# EAGLE design QuackDrive (EAGLE 9.5.1)

## Sheet 1 of 3
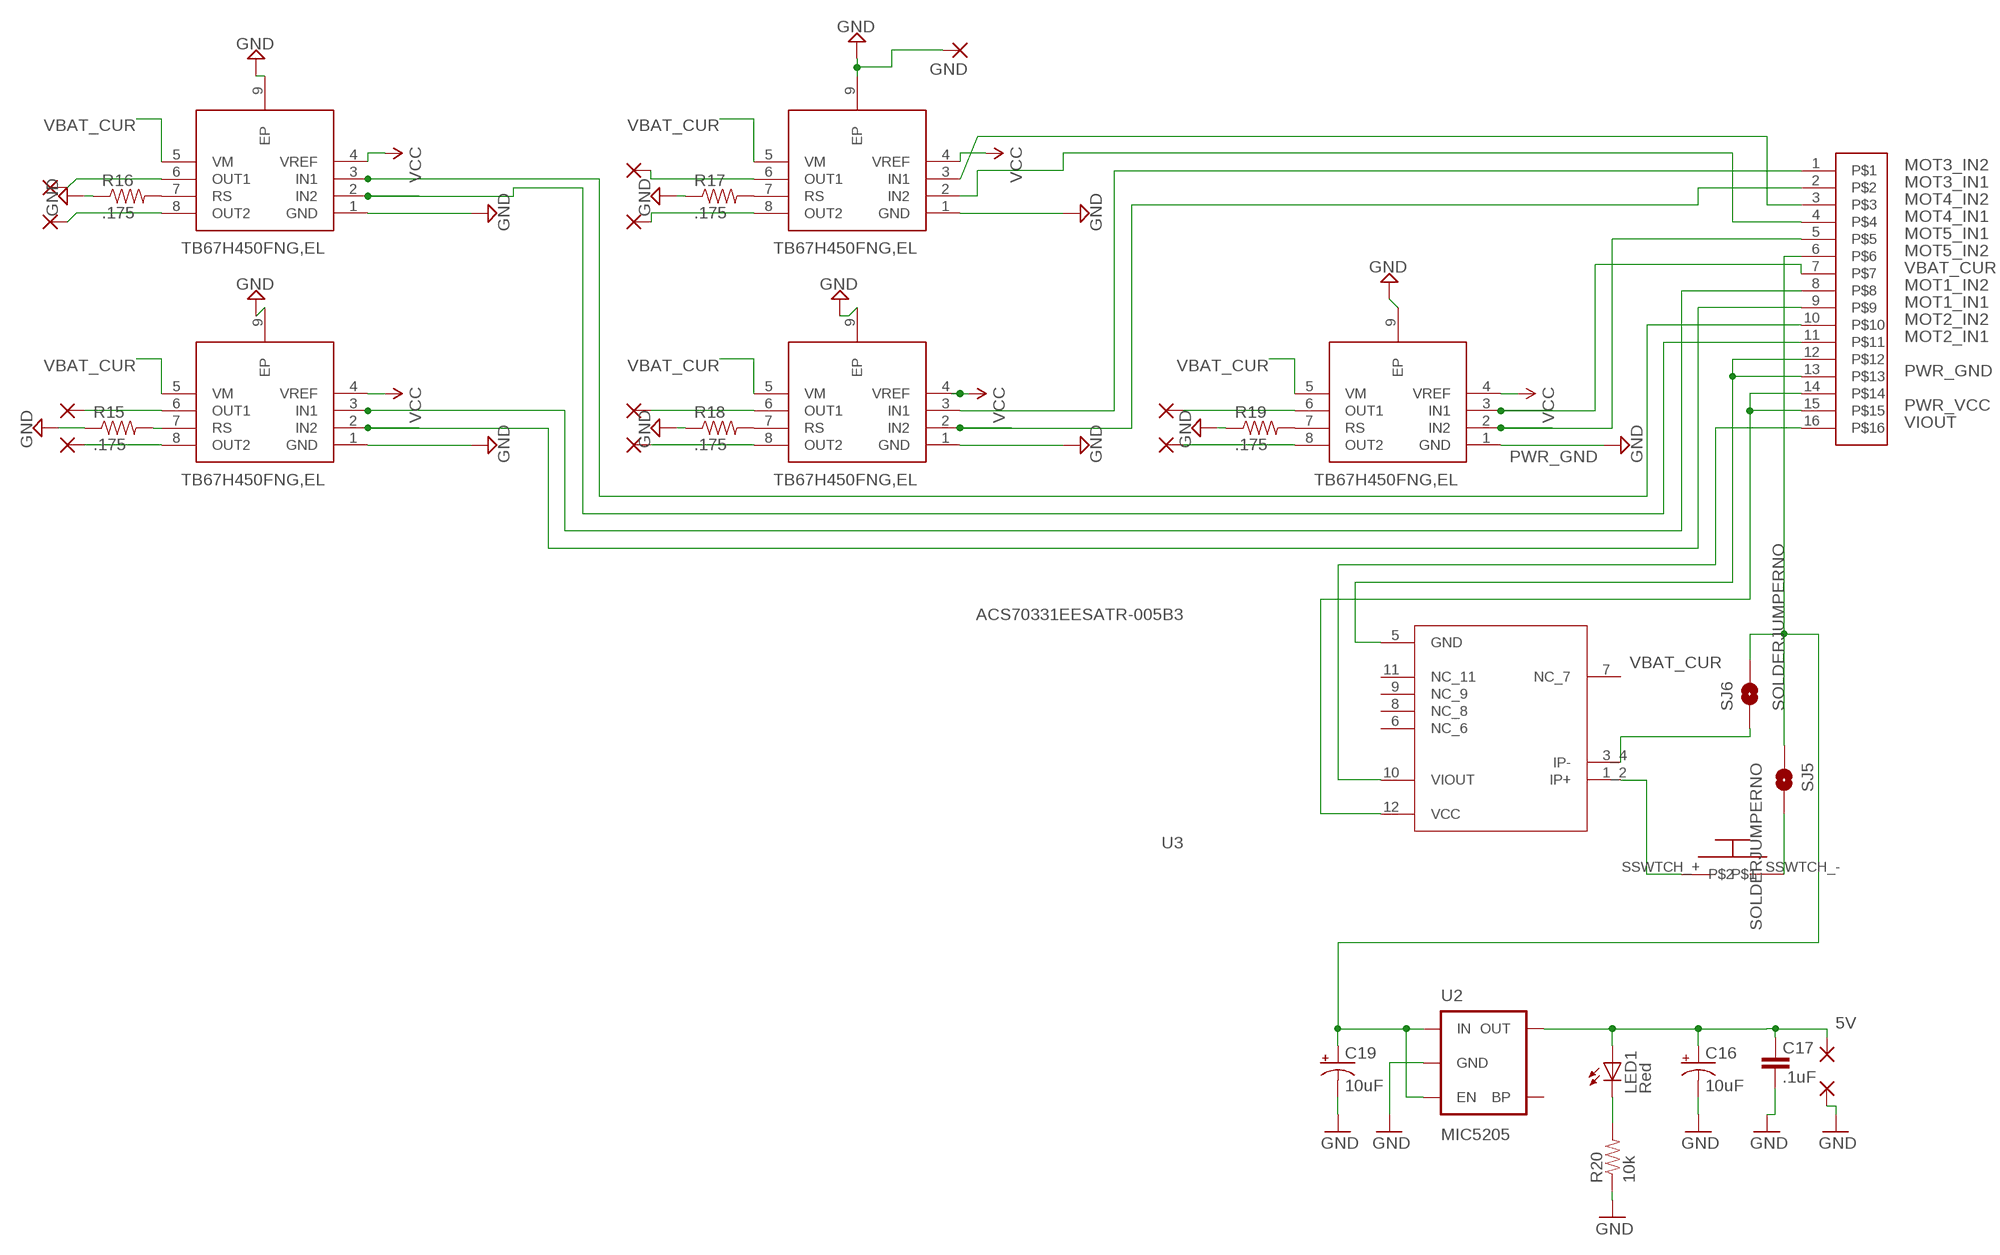
[diagram p0: schematic, sheet 1, part 1 of 2]
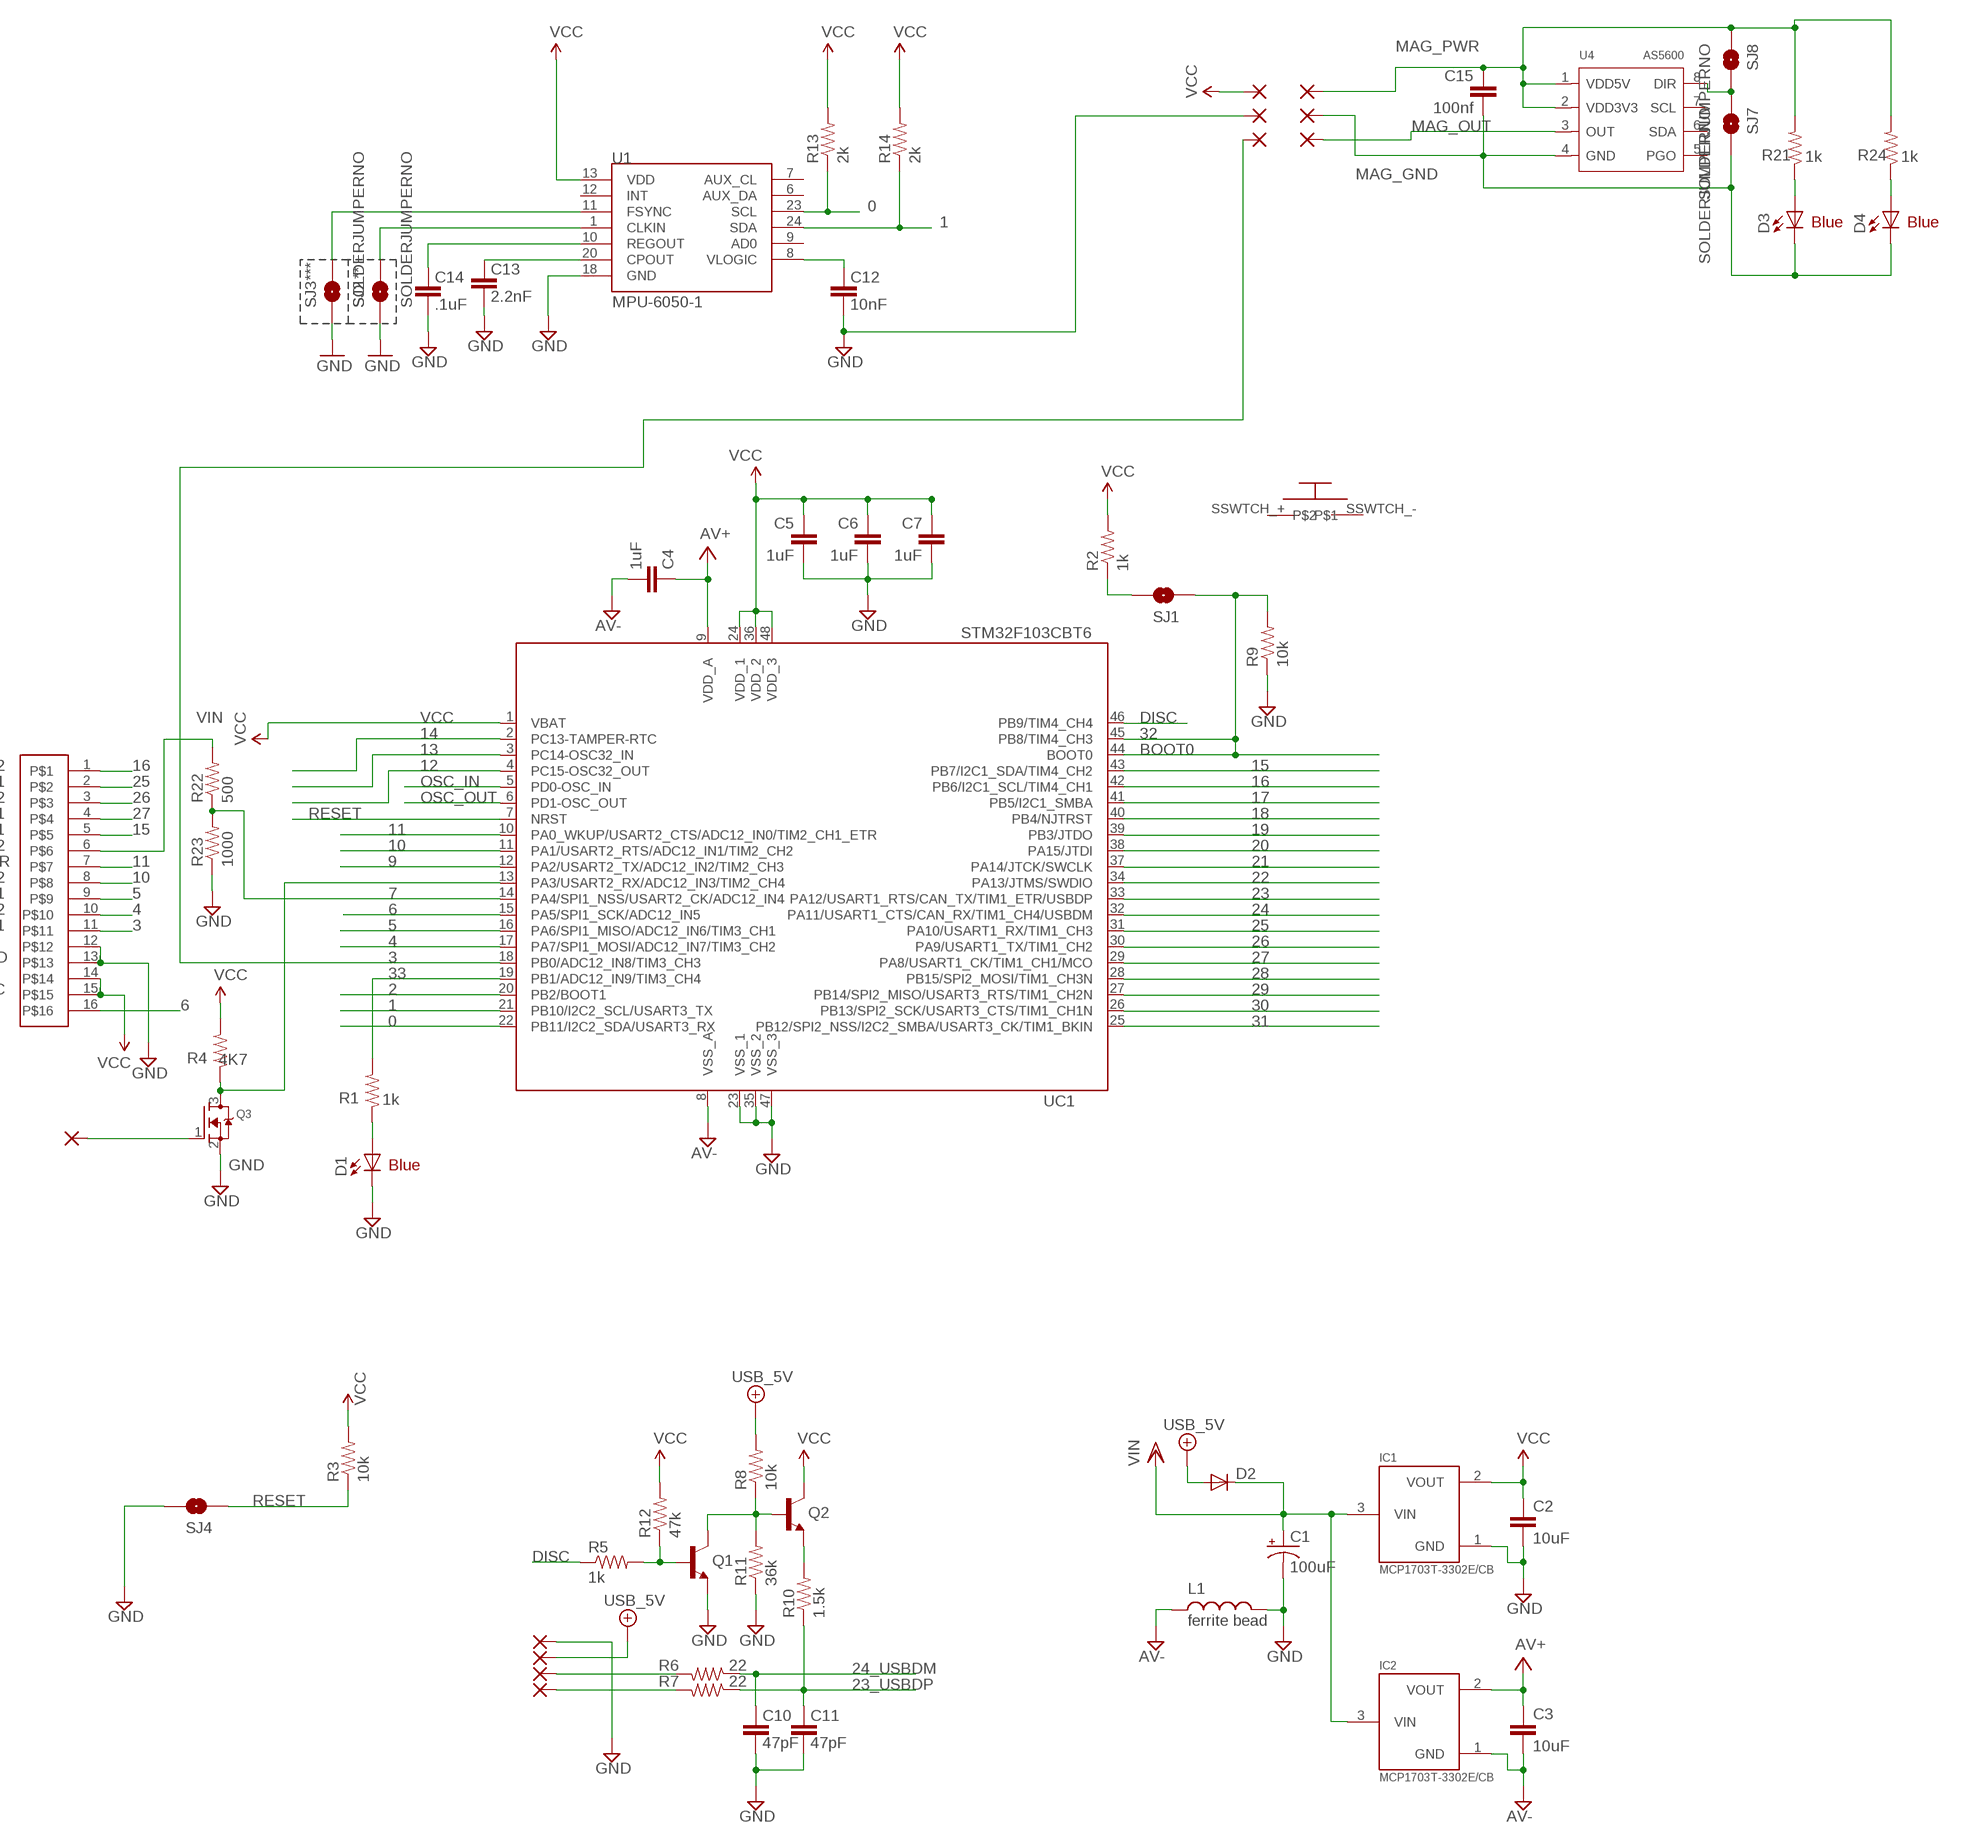
[diagram p1: schematic, sheet 1, part 2 of 2]

### Parts
C1  100uF  CAP_POL1206  [EIA3216]
C2  10uF  CAP0805  [0805]
C3  10uF  CAP0805  [0805]
C4  1uF  CAP0402  [C0402]
C5  1uF  CAP0402  [C0402]
C6  1uF  CAP0402  [C0402]
C7  1uF  CAP0402  [C0402]
C10  47pF  CAP0402  [C0402]
C11  47pF  CAP0402  [C0402]
C12  10nF  CAP0402  [C0402]
C13  2.2nF  CAP0402  [C0402]
C14  .1uF  CAP0402  [C0402]
C15  100nf  CAP0402  [C0402]
C16  10uF  CAP_POL1206  [EIA3216]
C17  .1uF  CAP0402  [C0402]
C19  10uF  CAP_POL1206  [EIA3216]
D1  Blue  LED1206  [LED-1206]
D2  DIODESOD  [SOD-323]
D3  Blue  LED1206  [LED-1206]
D4  Blue  LED1206  [LED-1206]
GND  SMD5  [SMD2,54-5,08]
IC1  MCP1703T-3302E/CB  MCP1700T  [SOT23]
IC2  MCP1703T-3302E/CB  MCP1700T  [SOT23]
IC4  TB67H450FNG,EL  [SOIC127P600X175-9N]
IC6  TB67H450FNG,EL  [SOIC127P600X175-9N]
IC8  TB67H450FNG,EL  [SOIC127P600X175-9N]
IC10  TB67H450FNG,EL  [SOIC127P600X175-9N]
IC12  TB67H450FNG,EL  [SOIC127P600X175-9N]
L1  ferrite bead  INDUCTOR0603  [0603]
LED1  Red  LED  [0603-LED-ALT1]
PAD1  WIREPADSMD1,27-254  [SMD1,27-2,54]
PAD2  WIREPADSMD1,27-254  [SMD1,27-2,54]
PAD3  WIREPADSMD1,27-254  [SMD1,27-2,54]
PAD4  SMD2  [SMD1,27-2,54]
PAD5  WIREPADSMD1,27-254  [SMD1,27-2,54]
PAD6  WIREPADSMD1,27-254  [SMD1,27-2,54]
PAD7  SMD2  [SMD1,27-2,54]
PAD8  WIREPADSMD1,27-254  [SMD1,27-2,54]
PAD9  WIREPADSMD1,27-254  [SMD1,27-2,54]
PAD10  WIREPADSMD1,27-254  [SMD1,27-2,54]
PAD11  WIREPADSMD1,27-254  [SMD1,27-2,54]
PAD12  WIREPADSMD1,27-254  [SMD1,27-2,54]
PAD13  SMD2  [SMD1,27-2,54]
PAD14  SMD2  [SMD1,27-2,54]
PAD15  SMD2  [SMD1,27-2,54]
PAD16  SMD2  [SMD1,27-2,54]
PAD17  SMD2  [SMD1,27-2,54]
PAD18  SMD2  [SMD1,27-2,54]
PAD19  SMD2  [SMD1,27-2,54]
PAD20  SMD2  [SMD1,27-2,54]
PAD21  SMD2  [SMD1,27-2,54]
PAD22  SMD2  [SMD1,27-2,54]
PAD23  SMD2  [SMD1,27-2,54]
Q1  NPN-BJT  TRANSISTOR_NPNSOT23  [SOT23]
Q2  NPN-BJT  TRANSISTOR_NPNSOT23  [SOT23]
Q3  MOSFET-NREFLOW  [SOT23]
R1  1k  RESISTOR0402  [C0402]
R2  1k  RESISTOR0402  [C0402]
R3  10k  RESISTOR0402  [C0402]
R4  4K7  RESISTOR0402  [C0402]
R5  1k  RESISTOR0402  [C0402]
R6  22  RESISTOR0402  [C0402]
R7  22  RESISTOR0402  [C0402]
R8  10k  RESISTOR0402  [C0402]
R9  10k  RESISTOR0402  [C0402]
R10  1.5k  RESISTOR0402  [C0402]
R11  36k  RESISTOR0402  [C0402]
R12  47k  RESISTOR0402  [C0402]
R13  2k  RESISTOR0402  [C0402]
R14  2k  RESISTOR0402  [C0402]
R15  .175  RESISTOR0402  [C0402]
R16  .175  RESISTOR0402  [C0402]
R17  .175  RESISTOR0402  [C0402]
R18  .175  RESISTOR0402  [C0402]
R19  .175  RESISTOR0402  [C0402]
R20  10k  RESISTOR0402  [C0402]
R21  1k  RESISTOR0402  [C0402]
R22  500  RESISTOR0402  [C0402]
R23  1000  RESISTOR0402  [C0402]
R24  1k  RESISTOR0402  [C0402]
SJ1  SOLDERJUMPERNO  [SJ_2S-NO]
SJ2  SOLDERJUMPERNO  [SJ_2S-NO]
SJ3  SOLDERJUMPERNO  [SJ_2S-NO]
SJ4  SOLDERJUMPERNO  [SJ_2S-NO]
SJ5  SOLDERJUMPERNO  [SJ_2S-NO]
SJ6  SOLDERJUMPERNO  [SJ_2S-NO]
SJ7  SOLDERJUMPERNO  [SJ_2S-NO]
SJ8  SOLDERJUMPERNO  [SJ_2S-NO]
U1  MPU-6050-1  [QFN-24-4MM2]
U2  MIC5205  V_REG_LDOSMD  [SOT23-5]
U3  ACS70331EESATR-005B3  [XDCR_ACS70331EESATR-005B3]
U4  AS5600  SENSOR-AS5600  [SOIC8-1.27-5X4MM]
U$1  WM8952DKR  [SOP80P420X355-16N]
U$2  SSWTCH  [SSWITCH]
U$3  WM8952DKR  [SOP80P420X355-16N]
U$4  SSWTCH  [SSWITCH]
UC1  STM32F103CBT6  STM32F103CB  [LQFP48]

### Nets
0: R13.1 U1.23(SCL) UC1.22(PB11/I2C2_SDA/USART3_RX)
1: R14.1 U1.24(SDA) UC1.21(PB10/I2C2_SCL/USART3_TX)
2: UC1.20(PB2/BOOT1)
3: PAD14.1(P) U$3.11 UC1.18(PB0/ADC12_IN8/TIM3_CH3)
4: U$3.10 UC1.17(PA7/SPI1_MOSI/ADC12_IN7/TIM3_CH2)
5: U$3.9 UC1.16(PA6/SPI1_MISO/ADC12_IN6/TIM3_CH1)
5V [vcc]: C16.A(+) C17.2 LED1.A PAD21.1(P) U2.5(OUT)
6: U$3.16 UC1.15(PA5/SPI1_SCK/ADC12_IN5)
7: R22.1 R23.2 UC1.14(PA4/SPI1_NSS/USART2_CK/ADC12_IN4)
9: UC1.12(PA2/USART2_TX/ADC12_IN2/TIM2_CH3)
10: U$3.8 UC1.11(PA1/USART2_RTS/ADC12_IN1/TIM2_CH2)
11: U$3.7 UC1.10(PA0_WKUP/USART2_CTS/ADC12_IN0/TIM2_CH1_ETR)
12: UC1.4(PC15-OSC32_OUT)
13: UC1.3(PC14-OSC32_IN)
14: UC1.2(PC13-TAMPER-RTC)
15: U$3.5 UC1.43(PB7/I2C1_SDA/TIM4_CH2)
16: U$3.1 UC1.42(PB6/I2C1_SCL/TIM4_CH1)
17: UC1.41(PB5/I2C1_SMBA)
18: UC1.40(PB4/NJTRST)
19: UC1.39(PB3/JTDO)
20: UC1.38(PA15/JTDI)
21: UC1.37(PA14/JTCK/SWCLK)
22: UC1.34(PA13/JTMS/SWDIO)
23: UC1.33(PA12/USART1_RTS/CAN_TX/TIM1_ETR/USBDP)
23_USBDP: C11.2 R7.1 R10.1
24: UC1.32(PA11/USART1_CTS/CAN_RX/TIM1_CH4/USBDM)
24_USBDM: C10.2 R6.1
25: U$3.2 UC1.31(PA10/USART1_RX/TIM1_CH3)
26: U$3.3 UC1.30(PA9/USART1_TX/TIM1_CH2)
27: U$3.4 UC1.29(PA8/USART1_CK/TIM1_CH1/MCO)
28: UC1.28(PB15/SPI2_MOSI/TIM1_CH3N)
29: UC1.27(PB14/SPI2_MISO/USART3_RTS/TIM1_CH2N)
30: UC1.26(PB13/SPI2_SCK/USART3_CTS/TIM1_CH1N)
31: UC1.25(PB12/SPI2_NSS/I2C2_SMBA/USART3_CK/TIM1_BKIN)
32: R9.2 SJ1.1 UC1.44(BOOT0) UC1.45(PB8/TIM4_CH3)
33: R1.2 UC1.19(PB1/ADC12_IN9/TIM3_CH4)
+5V/2: D2.2(A) PAD18.1(P) R8.2 ; supply symbol labelled USB_5V
AV+: C3.1 C4.1 IC2.2(VOUT) UC1.9(VDD_A)
AV-: C3.2 C4.2 IC2.1(GND) L1.1 UC1.8(VSS_A)
CLKIN1: SJ2.2 U1.1(CLKIN)
DISC: R5.1 UC1.46(PB9/TIM4_CH4)
FSYNC1: SJ3.2 U1.11(FSYNC)
GND: C1.C(-) C2.2 C5.2 C6.2 C7.2 C10.1 C11.1 C12.1 C13.1 C14.1 D1.C IC1.1(GND) L1.2 PAD15.1(P) PAD17.1(P) Q1.2(E) Q3.2(S) R9.1 R11.1 R23.1 SJ2.1 SJ3.1 SJ4.2 U1.18(GND) U$3.12 U$3.13 UC1.23(VSS_1) UC1.35(VSS_2) UC1.47(VSS_3)
MAG_GND: C15.2 D3.C D4.C PAD4.1(P) SJ7.2 U4.4(GND)
MAG_OUT: PAD13.1(P) U4.3(OUT)
MAG_PWR: C15.1 PAD7.1(P) R21.2 R24.2 SJ8.1 U4.1(VDD5V) U4.2(VDD3V3)
MOT1_IN1: IC4.2(IN2) U$1.9
MOT1_IN2: IC4.3(IN1) U$1.8
MOT2_IN1: IC6.2(IN2) U$1.11
MOT2_IN2: IC6.3(IN1) U$1.10
MOT3_IN1: IC8.2(IN2) U$1.2
MOT3_IN2: IC8.3(IN1) U$1.1
MOT4_IN1: IC10.2(IN2) U$1.4
MOT4_IN2: IC10.3(IN1) U$1.3
MOT5_IN1: IC12.2(IN2) U$1.5
MOT5_IN2: IC12.3(IN1) U$1.7
N$1: R2.1 SJ1.2
N$2: D1.A R1.1
N$4: Q3.3(D) R4.1 UC1.13(PA3/USART2_RX/ADC12_IN3/TIM2_CH4)
N$6: SJ5.2 U$2.SSWTCH_-
N$7: C12.2 U1.8(VLOGIC)
N$8: C13.2 U1.20(CPOUT)
N$9: C14.2 U1.10(REGOUT)
N$11: IC12.8(OUT2) PAD5.1(P)
N$12: IC6.7(RS) R16.2
N$13: IC12.6(OUT1) PAD6.1(P)
N$14: IC8.6(OUT1) PAD2.1(P)
N$15: IC8.8(OUT2) PAD1.1(P)
N$17: IC10.6(OUT1) PAD8.1(P)
N$18: IC10.8(OUT2) PAD3.1(P)
N$19: IC6.6(OUT1) PAD12.1(P)
N$20: IC6.8(OUT2) PAD11.1(P)
N$21: IC4.6(OUT1) PAD10.1(P)
N$22: IC4.8(OUT2) PAD9.1(P)
N$23: IC10.7(RS) R17.2
N$24: IC8.7(RS) R18.2
N$25: IC12.7(RS) R19.2
N$26: IC4.7(RS) R15.2
N$28: D3.A R21.1
N$29: SJ7.1 SJ8.2 U4.8(DIR)
N$30: LED1.C R20.2
N$32: D4.A R24.1
N$51: Q2.2(E) R10.2
N$59: PAD19.1(P) R6.2
N$60: PAD20.1(P) R7.2
N$71: Q1.3(C) Q2.1(B) R8.1 R11.2
N$73: Q1.1(B) R5.2 R12.1
OSC_IN: UC1.5(PD0-OSC_IN)
OSC_OUT: UC1.6(PD1-OSC_OUT)
PWR_GND: C16.C(-) C17.1 C19.C(-) GND.1(P) IC4.1(GND) IC4.9(EP) IC6.1(GND) IC6.9(EP) IC8.1(GND) IC8.9(EP) IC10.1(GND) IC10.9(EP) IC12.1(GND) IC12.9(EP) PAD22.1(P) R15.1 R16.1 R17.1 R18.1 R19.1 R20.1 U2.2(GND) U3.5(GND) U$1.12 U$1.13 ; supply symbol labelled GND
PWR_VCC: IC4.4(VREF) IC6.4(VREF) IC8.4(VREF) IC10.4(VREF) IC12.4(VREF) U3.12(VCC) U$1.14 U$1.15 ; supply symbol labelled VCC
RESET: R3.1 SJ4.1 UC1.7(NRST)
SBUSIN: PAD23.1(P) Q3.1(G)
VBAT_CUR: C19.A(+) IC4.5(VM) IC6.5(VM) IC8.5(VM) IC10.5(VM) IC12.5(VM) SJ5.1 SJ6.1 SJ6.2 U2.1(IN) U2.3(EN) U3.3_4(IP-) U$1.6
VBAT_IN: U3.1_2(IP+) U$2.SSWTCH_+
VCC: C2.1 C5.1 C6.1 C7.1 IC1.2(VOUT) PAD16.1(P) Q2.3(C) R2.2 R3.2 R4.2 R12.2 R13.2 R14.2 U1.13(VDD) U$3.14 U$3.15 UC1.1(VBAT) UC1.24(VDD_1) UC1.36(VDD_2) UC1.48(VDD_3)
VIN: C1.A(+) D2.1(C) IC1.3(VIN) IC2.3(VIN) R22.2 U$3.6
VIOUT: U3.10(VIOUT) U$1.16
Unconnected: U1.6(AUX_DA) U1.7(AUX_CL) U1.9(AD0) U1.12(INT) U2.4(BP) U3.6(NC_6) U3.7(NC_7) U3.8(NC_8) U3.9(NC_9) U3.11(NC_11) U4.5(PGO) U4.6(SDA) U4.7(SCL) U$4.SSWTCH_+ U$4.SSWTCH_-

### Notes on the sheet
- Blue | Blue
- *** | **
- BOOT0
- Blue

## Sheet 2 of 3
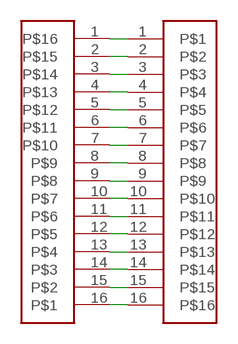
[diagram p2: schematic, sheet 2]

### Parts
U$5  WM8952DKR  [SOP80P420X355-16N]
U$6  WM8952DKR  [SOP80P420X355-16N]

### Nets
N$16: U$5.1 U$6.1
N$34: U$5.2 U$6.2
N$35: U$5.3 U$6.3
N$36: U$5.4 U$6.4
N$37: U$5.5 U$6.5
N$38: U$5.6 U$6.6
N$39: U$5.7 U$6.7
N$40: U$5.8 U$6.8
N$41: U$5.9 U$6.9
N$42: U$5.10 U$6.10
N$43: U$5.11 U$6.11
N$44: U$5.12 U$6.12
N$45: U$5.13 U$6.13
N$46: U$5.14 U$6.14
N$47: U$5.15 U$6.15
N$48: U$5.16 U$6.16

## Sheet 3 of 3
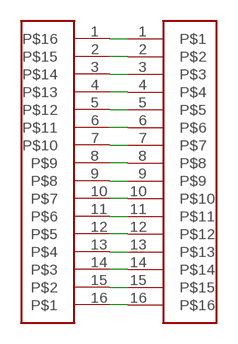
[diagram p3: schematic, sheet 3]

### Parts
U$7  WM8952DKR  [SOP80P420X355-16N]
U$8  WM8952DKR  [SOP80P420X355-16N]

### Nets
N$33: U$7.1 U$8.1
N$49: U$7.2 U$8.2
N$50: U$7.3 U$8.3
N$52: U$7.4 U$8.4
N$53: U$7.5 U$8.5
N$54: U$7.6 U$8.6
N$55: U$7.7 U$8.7
N$56: U$7.8 U$8.8
N$57: U$7.9 U$8.9
N$58: U$7.10 U$8.10
N$61: U$7.11 U$8.11
N$62: U$7.12 U$8.12
N$63: U$7.13 U$8.13
N$64: U$7.14 U$8.14
N$65: U$7.15 U$8.15
N$66: U$7.16 U$8.16

## Library data of the parts
C1 = SparkFun3:CAP_POL: Capacitor Polarized These are standard SMD and PTH capacitors. Normally 10uF, 47uF, and 100uF in electrolytic and tantalum varieties. Always verify the external diameter of the through hole cap, it varies with capacity, voltage, and manufacturer. The EIA devices should be standard.
C2 C3 = SparkFun2:CAP: Capacitor Standard 0603 ceramic capacitor, and 0.1" leaded capacitor.
C4-C7 C10-C15 C17 = SparkFun:CAP: Capacitor Standard 0603 ceramic capacitor, and 0.1" leaded capacitor.
C16 C19 = SparkFun:CAP_POL: Capacitor Polarized These are standard SMD and PTH capacitors. Normally 10uF, 47uF, and 100uF in electrolytic and tantalum varieties. Always verify the external diameter of the through hole cap, it varies with capacity, voltage, and manufacturer. The EIA devices should be standard.
D1 D3 D4 = SparkFun:LED: LEDs Standard schematic elements and footprints for 5mm, 3mm, 1206, and 0603 sized LEDs. 5mm - Spark Fun Electronics SKU : COM-00529 (and others)
D2 = SparkFun3:DIODE: Diode These are standard reverse protection diodes and small signal diodes. SMA package can handle up to about 1A. SOD-323 can handle about 200mA. What the SOD-323 package when ordering, there are some mfgs out there that are 5-pin packages.
GND = wirepad:SMD5: SMD PAD
IC1 IC2 = okie:MCP1700T
IC4 IC6 IC8 IC10 IC12 = TB67H450FNG_EL:TB67H450FNG,EL: Motor / Motion / Ignition Controllers & Drivers Brushed Motor Driver IC, 50V, 3.5A, TSSOP8 Package, PB-FREE Source: Datasheet <http://toshiba.semicon-storage.com/info/docget.jsp?did=65346&prodName=TB67H450FNG>; DESCRIPTION: Motor / Motion / Ignition Controllers & Drivers Brushed Motor Driver IC, 50V, 3.5A, TSSOP8 Package, PB-FREE; HEIGHT: 1.75mm; MANUFACTURER_NAME: Toshiba; MANUFACTURER_PART_NUMBER: TB67H450FNG,EL; MOUSER_PART_NUMBER: 757-TB67H450FNGEL; MOUSER_PRICE-STOCK: https://www.mouser.com/Search/Refine.aspx?Keyword=757-TB67H450FNGEL
L1 = SparkFun3:INDUCTOR: Inductors Basic Inductor/Choke - 0603 and 1206. Footprints are not proven and vary greatly between part numbers.
LED1 = Testing:LED: LEDs Standard schematic elements and footprints for 5mm, 3mm, 1206, and 0603 sized LEDs. 5mm - Spark Fun Electronics SKU : COM-00529 (and others)
PAD1-PAD3 PAD5 PAD6 PAD8-PAD12 = wirepad:WIREPAD: Wire PAD connect wire on PCB
PAD4 PAD7 PAD13-PAD23 = wirepad:SMD2: SMD PAD
Q1 Q2 = SparkFun2:TRANSISTOR_NPN: Transistor NPN BJT configuration in SOT23 package. MMBT2222 is the common NPN we use. Double check BCE configuration again layout.
Q3 = adafruit:MOSFET-N: N-Channel Mosfet 2N7002E - 60V 260mA SOT23 [Digikey: 2N7002ET1GOSTR-ND] - REEL BSH103 - 30V 850mA SOT23 [Digikey: 568-5013-1-ND]
R1-R24 = SparkFun:RESISTOR: Resistor Basic schematic elements and footprints for 0603, 1206, and PTH 1/10th watt (small) resistors.
SJ1-SJ8 = SparkFun:SOLDERJUMPER: Solder Jumper Standard SMD solder jumper. Used to automate production. Two varients : Normally Open and Normally Closed are the same, but have different paste layers. NC will have a large amount of paste and should jumper during reflow.
U1 = Testing:MPU-6050
U2 = SparkFun:V_REG_LDO: Voltage Regulator LDO Standard 150mA LDO voltage regulator in SOT-23 layout. Micrel part MIC5205. BP (by-pass) pin is used to lower output noise with 470pF cap.
U3 = ACS70331EESATR-005B3:ACS70331EESATR-005B3: Current Sensor Current Sensor AC/DC Current 12-Pin QFN EP T/R; DESCRIPTION: Current Sensor Current Sensor AC/DC Current 12-Pin QFN EP T/R; DIGI-KEY_PART_NUMBER: 620-1887-1-ND; DIGI-KEY_PURCHASE_URL: https://www.digikey.com/product-detail/en/allegro-microsystems/ACS70331EESATR-005B3/620-1887-1-ND/8120687?utm_source=snapeda&utm_medium=aggregator&utm_campaign=symbol; MF: Allegro MicroSystems LLC; MP: ACS70331EESATR-005B3; PACKAGE: WFQFN-12 Allegro MicroSystems LLC
U4 = Sensor:SENSOR-AS5600
U$1 U$5 = WM8952DKR:WM8952DKR
U$2 = Safet switch:SSWTCH
U$3 = WM8952DKR FW:WM8952DKR
U$4 = Safet switch other side:SSWTCH
U$6 = WM8952DKR other half:WM8952DKR
U$7 = WM8952DKR F:WM8952DKR
U$8 = WM8952DKR F other half:WM8952DKR
UC1 = stm32:STM32F103CB

## Net classes
0 Default: width 0.203 mm
1 vcc: width 0.254 mm

## Board
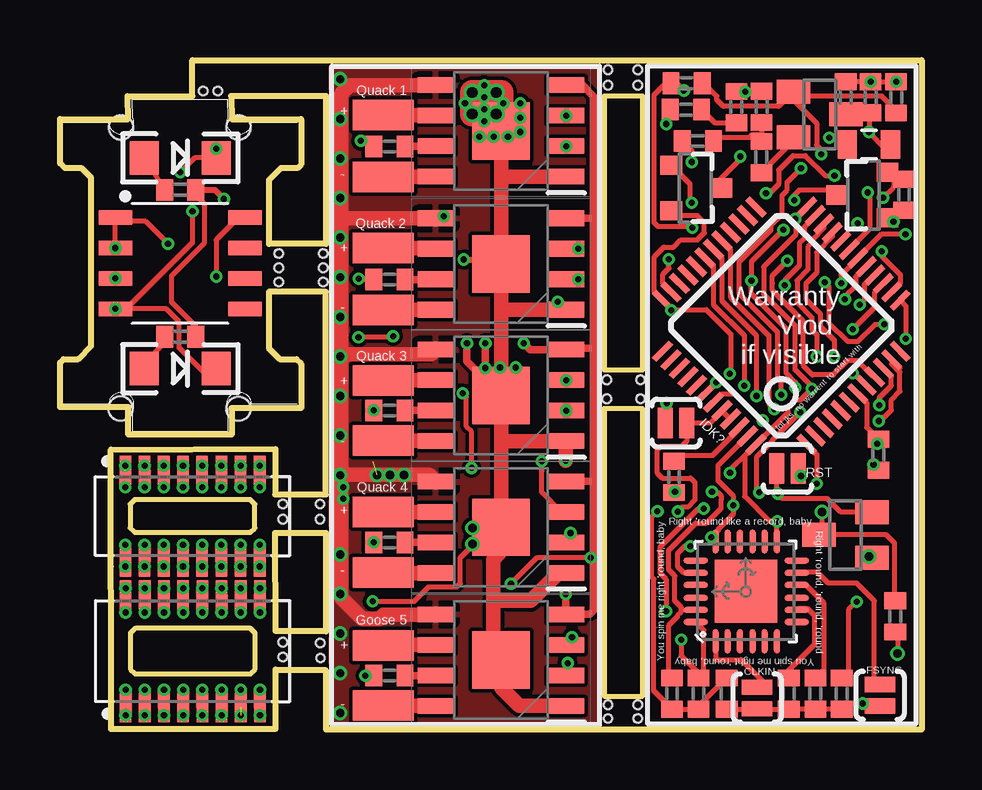
[diagram p4: board, top side]
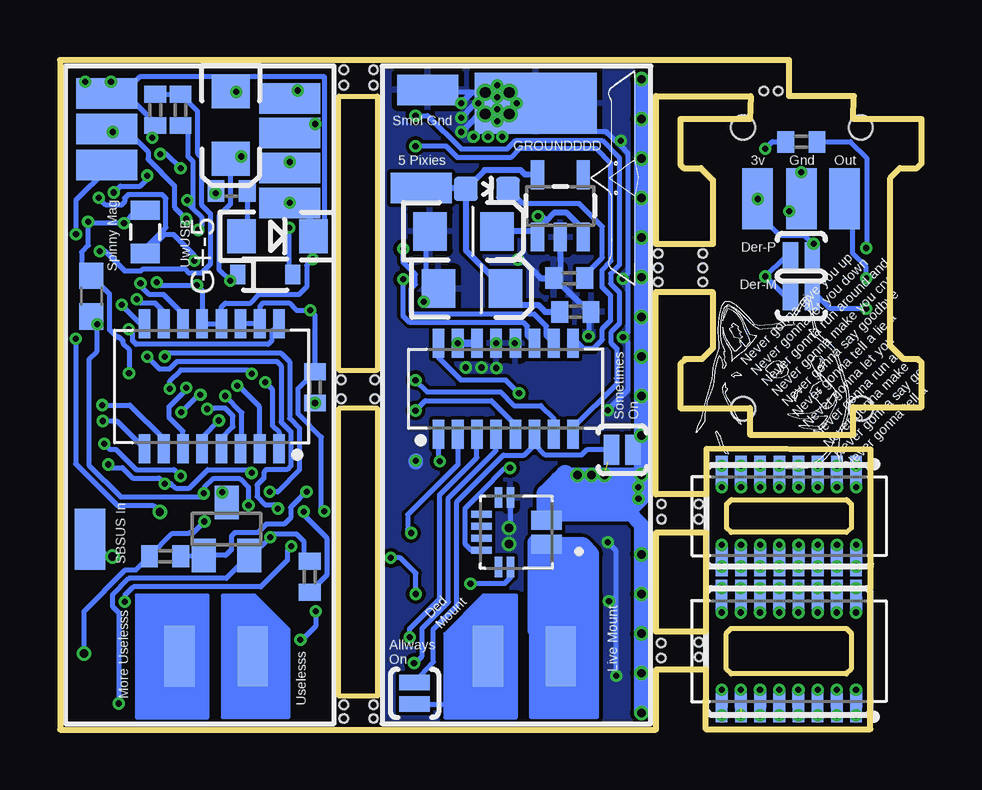
[diagram p5: board, bottom side, seen from below]

Size 35.9 x 27.9 mm. Coordinates in mm from the lower left corner, seen from the top.
Outline: 2.12,11.67 2.13,0.02 8.98,0.02 8.98,2.5 11.07,2.49 11.08,0 35.9,0 35.9,27.9 5.52,27.9 5.52,26.4 2.82,26.4 2.84,25.44 0,25.44 0,23.59 0.2,23.39 0.9,23.39 1.3,22.99 1.3,15.99 0.75,15.44 0.15,15.44 0,15.29 0,13.44 2.85,13.44 2.85,12.29 7.15,12.29 7.15,13.39 10.05,13.39 10.05,15.24 9.85,15.44 9.15,15.44 8.7,15.89 8.71,18.23 11.08,18.24 11.08,9.8 8.97,9.8 8.97,11.69 2.12,11.67
Outline: 2.12,6.8 2.12,11.67
Outline: 8.97,8.2 8.98,4.1 11.07,4.1 11.08,8.2 8.97,8.2
Outline: 8.97,6.8 8.97,8.2
Outline: 24.28,26.4 22.68,26.4 22.68,14.98 24.28,14.98 24.28,26.4
Outline: 22.68,13.38 22.68,1.4 24.28,1.4 24.28,13.38 22.68,13.38
Outline: 11.08,26.4 11.08,20.24 8.7,20.23 8.7,22.89 9.2,23.39 9.9,23.39 10.05,23.54 10.05,25.44 7.15,25.44 7.13,26.4 11.08,26.4
Outline: 8.13,8.39 8.13,9.39 7.93,9.58 3.13,9.58 2.93,9.39 2.93,8.39 3.13,8.22 7.93,8.22 8.13,8.39
Outline: 8.13,2.52 8.13,4.02 7.93,4.22 3.13,4.22 2.93,4.02 2.93,2.52 3.13,2.32 7.93,2.32 8.13,2.52
Copper layers (1*16): Top 0.07mm / dielectric 0.8mm / Bottom 0.07mm
Design rules "default *": minimum track width 6mil, minimum drill 10mil, track to track 6mil, track to pad 6mil, pad to pad 6mil, via to via 6mil, smd to smd 0mil, copper to edge 6mil, drill to drill 6mil, minimum pad ring 5mil, minimum via ring 5mil, stop-mask expansion 4mil, vias tented up to drill 50mil, thermal gap 10mil
Holes 1 mm at 2.54,25.09 7.44,25.08 7.44,13.37 2.53,13.38
Holes 0.35 mm at 5.97,26.61 6.58,26.61 9.12,18.65 9.12,19.25 9.12,19.84 10.97,18.65 10.97,19.25 10.97,19.84 9.29,9.4 9.29,8.76 10.84,9.4 10.84,8.76 9.29,3.64 9.28,3.02 10.85,2.98 10.84,3.6 22.84,1.04 22.84,0.46 24.07,1.04 24.07,0.46 22.84,27.5 22.84,26.85 24.07,27.5 24.07,26.85 22.79,13.78 22.79,14.58 24.19,14.58 24.19,13.78

### Footprints (pad centres in the part's own frame; a part is rotated, then mirrored left to right if it is on the bottom)
EIA3216 = smd 1.4 x 1.6: A 1.4,0; C -1.4,0
0805 = smd 0.8 x 1.2: 1 -0.9,0; 2 0.9,0
C0402 = smd 0.7 x 0.9: 1 -0.65,0; 2 0.65,0
LED-1206 = smd 1.2 x 1.4: A -1.5,0; C 1.5,0
SOD-323 = smd 0.63 x 0.83: 1 -1.15,0; 2 1.15,0
SMD2,54-5,08 = smd 2.54 x 5.08: 1 0,0
SOT23 = smd 0.8 x 0.9: 1 -0.95,-1; 2 0.95,-1; 3 0,1.1
SOIC127P600X175-9N = smd 1.525 x 0.65: 1 -2.712,1.905; 2 -2.712,0.635; 3 -2.712,-0.635; 4 -2.712,-1.905; 5 2.712,-1.905; 6 2.712,-0.635; 7 2.712,0.635; 8 2.712,1.905 | smd 2.39 x 2.39: 9 0,0
0603 = smd 1.1 x 1: 1 -0.85,0; 2 0.85,0
0603-LED-ALT1 = smd 1 x 1: A 0,-0.877; C 0,0.877
SMD1,27-2,54 = smd 1.27 x 2.54: 1 0,0
SOT23' = smd 1 x 1.4: 1 -0.95,-1.1; 2 0.95,-1.1; 3 0,1.1
SJ_2S-NO = smd 0.635 x 1.27: 1 -0.45,0; 2 0.45,0
QFN-24-4MM2 = smd 1.016 x 0.254: 1 -2.066,1.257; 2 -2.066,0.75; 3 -2.066,0.247; 4 -2.066,-0.287; 5 -2.066,-0.792; 6 -2.066,-1.297; 13 2.086,-1.297; 14 2.086,-0.792; 15 2.086,-0.287; 16 2.086,0.247; 17 2.086,0.75; 18 2.086,1.257 | smd 0.254 x 1.016: 7 -1.267,-2.122; 8 -0.762,-2.122; 9 -0.258,-2.122; 10 0.278,-2.122; 11 0.78,-2.122; 12 1.287,-2.122; 19 1.287,2.082; 20 0.78,2.082; 21 0.278,2.082; 22 -0.258,2.082; 23 -0.762,2.082; 24 -1.267,2.082 | smd 2.616 x 2.616: P$1 0.02,-0.01
SOT23-5 = smd 0.55 x 1.2: 1 -0.95,-1.3; 2 0,-1.3; 3 0.95,-1.3; 4 0.95,1.3; 5 -0.95,1.3
XDCR_ACS70331EESATR-005B3 = smd 1.27 x 0.8: 1_2 -1.25,0.5; 3_4 -1.25,-0.5 | smd 0.3 x 0.85: 5 0.25,-1.45; 6 0.75,-1.45; 11 0.75,1.45; 12 0.25,1.45 | smd 0.85 x 0.3: 7 1.45,-0.75; 8 1.45,-0.25; 9 1.45,0.25; 10 1.45,0.75
SOIC8-1.27-5X4MM = smd 0.6 x 1.4: 1 -1.905,-2.7; 2 -0.635,-2.7; 3 0.635,-2.7; 4 1.905,-2.7; 5 1.905,2.7; 6 0.635,2.7; 7 -0.635,2.7; 8 -1.905,2.7
SOP80P420X355-16N = smd 1.212 x 0.484: 1 -1.9,2.8; 2 -1.9,2; 3 -1.9,1.2; 4 -1.9,0.4; 5 -1.9,-0.4; 6 -1.9,-1.2; 7 -1.9,-2; 8 -1.9,-2.8; 9 1.9,-2.8; 10 1.9,-2; 11 1.9,-1.2; 12 1.9,-0.4; 13 1.9,0.4; 14 1.9,1.2; 15 1.9,2; 16 1.9,2.8
SSWITCH = smd 1.25 x 2.5: SSWTCH_+ 0,0 | smd 1.27 x 2.54: SSWTCH_- 3.048,0
SOP80P420X355-16N' = smd 1.212 x 0.484: 1 -3.304,-2.8; 2 -3.304,-2; 3 -3.304,-1.2; 4 -3.304,-0.4; 5 -3.304,0.4; 6 -3.304,1.2; 7 -3.304,2; 8 -3.304,2.8; 9 1.91,2.8; 10 1.91,2; 11 1.91,1.2; 12 1.91,0.4; 13 1.91,-0.4; 14 1.91,-1.2; 15 1.91,-2; 16 1.91,-2.8
SOP80P420X355-16N'' = smd 1.212 x 0.484: 1 1.91,2.8; 2 1.91,2; 3 1.91,1.2; 4 1.91,0.4; 5 1.91,-0.4; 6 1.91,-1.2; 7 1.91,-2; 8 1.91,-2.8; 9 -1.91,-2.8; 10 -1.91,-2; 11 -1.91,-1.2; 12 -1.91,-0.4; 13 -1.91,0.4; 14 -1.91,1.2; 15 -1.91,2; 16 -1.91,2.8
SOP80P420X355-16N''' = smd 1.212 x 0.484: 1 -2.8,2.8; 2 -2.8,2; 3 -2.8,1.2; 4 -2.8,0.4; 5 -2.8,-0.4; 6 -2.8,-1.2; 7 -2.8,-2; 8 -2.8,-2.8; 9 1.9,-2.8; 10 1.9,-2; 11 1.9,-1.2; 12 1.9,-0.4; 13 1.9,0.4; 14 1.9,1.2; 15 1.9,2; 16 1.9,2.8
SOP80P420X355-16N'''' = smd 1.212 x 0.484: 1 1.91,2.8; 2 1.91,2; 3 1.91,1.2; 4 1.91,0.4; 5 1.91,-0.4; 6 1.91,-1.2; 7 1.91,-2; 8 1.91,-2.8; 9 -2.81,-2.8; 10 -2.81,-2; 11 -2.81,-1.2; 12 -2.81,-0.4; 13 -2.81,0.4; 14 -2.81,1.2; 15 -2.81,2; 16 -2.81,2.8
LQFP48 = smd 0.254 x 1: 1 -2.75,-4.25; 2 -2.25,-4.25; 3 -1.75,-4.25; 4 -1.25,-4.25; 5 -0.75,-4.25; 6 -0.25,-4.25; 7 0.25,-4.25; 8 0.75,-4.25; 9 1.25,-4.25; 10 1.75,-4.25; 11 2.25,-4.25; 12 2.75,-4.25; 25 2.75,4.25; 26 2.25,4.25; 27 1.75,4.25; 28 1.25,4.25; 29 0.75,4.25; 30 0.25,4.25; 31 -0.25,4.25; 32 -0.75,4.25; 33 -1.25,4.25; 34 -1.75,4.25; 35 -2.25,4.25; 36 -2.75,4.25 | smd 1 x 0.254: 13 4.25,-2.75; 14 4.25,-2.25; 15 4.25,-1.75; 16 4.25,-1.25; 17 4.25,-0.75; 18 4.25,-0.25; 19 4.25,0.25; 20 4.25,0.75; 21 4.25,1.25; 22 4.25,1.75; 23 4.25,2.25; 24 4.25,2.75; 37 -4.25,2.75; 38 -4.25,2.25; 39 -4.25,1.75; 40 -4.25,1.25; 41 -4.25,0.75; 42 -4.25,0.25; 43 -4.25,-0.25; 44 -4.25,-0.75; 45 -4.25,-1.25; 46 -4.25,-1.75; 47 -4.25,-2.25; 48 -4.25,-2.75

### Placement (x,y rotation side)
C1  28.78,25.19 270 bottom
C2  33.71,24.38 180 top
C3  32.35,20.74 90 bottom
C4  35.17,22.29 270 top
C5  32.74,26.35 90 top
C6  27.78,1.5 270 top
C7  33.78,26.35 90 top
C10  28.18,25.94 270 top
C11  29.24,25.95 270 top
C12  30.36,1.5 90 top
C13  32.57,1.5 90 top
C14  31.47,1.5 90 top
C15  5.01,24.49 180 bottom
C16  18.74,18.37 0 bottom
C17  14.42,17.41 180 bottom
C19  19.08,20.76 0 bottom
D1  26.84,20.56 0 bottom
D2  27.35,18.96 0 bottom
D3  5.01,23.82 0 top
D4  5.01,15.04 0 top
GND  16.08,26.1 90 bottom
IC1  26.47,22.57 270 top
IC2  33.48,22.28 90 top
IC4  18.38,24.95 180 top
IC6  18.38,19.4 180 top
IC8  18.38,8.43 180 top
IC10  18.38,2.9 180 top
IC12  18.38,13.93 180 top
L1  34.6,18.06 270 bottom
LED1  18.11,22.53 270 bottom
PAD1  13.48,6.55 90 top
PAD2  13.48,9.07 270 top
PAD3  13.48,1 90 top
PAD4  5.01,22.11 0 bottom
PAD5  13.48,12.04 90 top
PAD6  13.48,14.54 90 top
PAD7  6.83,22.11 0 bottom
PAD8  13.48,3.5 90 top
PAD9  13.48,23.03 270 top
PAD10  13.48,25.6 270 top
PAD11  13.48,17.49 90 top
PAD12  13.48,20.06 270 top
PAD13  3.22,22.11 0 bottom
PAD14  33.96,23.53 270 bottom
PAD15  33.96,26.51 270 bottom
PAD16  33.96,25.02 270 bottom
PAD17  26.33,21.95 270 bottom
PAD18  26.33,26.3 270 bottom
PAD19  26.33,24.85 270 bottom
PAD20  26.33,23.4 270 bottom
PAD21  20.85,22.57 270 bottom
PAD22  20.57,26.65 270 bottom
PAD23  34.65,7.92 0 bottom
Q1  NPN-BJT  [SOT23']  28.96,8.36 0 bottom
Q2  NPN-BJT  [SOT23']  31.66,25.63 270 top
Q3  [SOT23']  32.73,8.11 90 top
R1  28.75,22.44 180 bottom
R2  25.27,14.26 90 bottom
R3  34.1,11.45 270 top
R4  34.8,4.72 270 top
R5  25.58,10.53 270 top
R6  26.08,25.83 180 top
R7  26.58,24.52 180 top
R8  26.11,26.93 180 top
R9  25.49,6.37 270 bottom
R10  29.22,23.85 270 top
R11  34.84,26.34 270 top
R12  31.52,7.23 180 bottom
R13  25.5,1.5 270 top
R14  26.6,1.5 270 top
R15  13.73,24.3 0 top
R16  13.73,18.75 0 top
R17  13.73,2.25 0 top
R18  13.73,7.8 0 top
R19  13.73,13.3 0 top
R20  14.68,18.81 0 bottom
R21  5.01,22.49 0 top
R22  30.88,25.82 270 bottom
R23  31.93,25.82 90 bottom
R24  5.01,16.37 0 top
SJ1  25.67,12.77 180 top
SJ2  29.05,1.32 90 top
SJ3  34.17,1.43 90 top
SJ4  30.31,10.88 180 top
SJ5  21.13,1.51 270 bottom
SJ6  12.47,11.66 180 bottom
SJ7  5.01,18.11 0 bottom
SJ8  5.01,19.68 180 bottom
U1  28.57,5.75 90 top
U2  15.05,21.82 0 bottom
U3  16.88,8.22 180 bottom
U4  5.01,19.43 270 top
U$1  17.33,14.2 90 bottom
U$2  15.03,3.05 180 bottom
U$3  WM8952DKR  [SOP80P420X355-16N']  29.58,15 90 bottom
U$4  27.88,3.05 180 bottom
U$5  5.52,8.89 270 bottom
U$6  WM8952DKR  [SOP80P420X355-16N'']  5.52,8.89 90 top
U$7  WM8952DKR  [SOP80P420X355-16N''']  5.53,3.72 90 top
U$8  WM8952DKR  [SOP80P420X355-16N'''']  5.53,2.82 270 bottom
UC1  30.06,16.83 45 top

### Tracks (layer width: path | path; a pad name or v marks a point on that pad's centre or on a via)
0  (via drill 0.25)
  Top 0.203: 25.89,4.99 U1.23 | 25.89,4.99 25.89,5.1 25.62,5.37 25.62,6.41 25.37,6.65 25.37,7.48 26.04,8.15 | 26.04,8.15 26.06,8.15 | R13.1 25.37,2.15 25.37,4.34 25.73,4.7 25.73,4.76 25.89,4.92 25.89,4.99 | UC1.22 31.83,20.9 31.36,20.44 31.36,20.31 31.17,20.12 31.17,19.17 30.71,18.72 30.71,17.79 31.33,17.17 31.33,16.67 31.54,16.45 v31.54,15.54 | 26.04,8.15 26.49,8.6 26.93,8.6 27.54,9.2 27.54,9.55 27.54,9.56 27.54,9.75 27.38,9.91 v27.17,9.91
  Bottom 0.203: v31.54,15.54 31.39,15.69 26.7,15.69 26.33,15.33 26.33,12.96 25.93,12.55 25.93,10.82 26.84,9.91 v27.17,9.91
1  (via drill 0.25)
  Top 0.203: U1.24 26.82,4.15 26.82,2.37 R14.1 26.6,2.36 25.88,3.08 v25.88,3.74 | v25.25,4.94 25.26,4.95 25.26,6.26 25.02,6.5 25.02,7.63 26.6,9.21 v26.82,9.21 | UC1.21 32.18,20.55 31.52,19.89 31.52,19.03 31.07,18.58 31.07,17.94 31.68,17.33 31.68,16.81 32.26,16.23 v32.26,15.54
  Bottom 0.203: v25.88,3.74 25.81,3.74 25.25,4.3 v25.25,4.94 | v32.26,15.54 31.76,15.03 31.33,15.03 31.02,15.34 26.86,15.34 26.69,15.17 26.69,12.82 26.28,12.41 26.28,10.99 26.44,10.83 27.3,10.83 27.41,10.72 27.41,10.48 27.69,10.2 27.69,9.71 27.36,9.38 26.99,9.38 v26.82,9.21
3  (via drill 0.25)
  Top 0.203: UC1.18 33.24,19.62 32.93,19.31 | v35.23,20.64 34.22,20.64 UC1.18 | UC1.18 32.55,18.96 v32.55,18.6
  Bottom 0.203: U$3.11 30.78,17.32 31.58,18.13 32.2,18.13 32.2,18.14 32.5,18.44 32.51,18.44 32.55,18.47 v32.55,18.6 | PAD14.1 33.96,23.33 35.24,22.05 35.24,20.65 v35.23,20.64
4  (via drill 0.25)
  Top 0.203: UC1.17 33.15,18.86 33.15,18.48 32.71,18.03 v32.71,17.93
  Bottom 0.203: v32.71,17.93 32.55,17.77 31.93,17.77 31.58,17.41 U$3.10
5  (via drill 0.25)
  Top 0.203: UC1.16 33.92,18.95 33.51,18.53 33.51,17.89 v33.33,17.71 v33.33,17.7
  Bottom 0.203: U$3.9 32.55,16.91 v33.33,17.69 v33.33,17.7
5V
  Bottom 0.254: PAD21.1 19.03,22.57 LED1.A | LED1.A 18.99,19.98 17.38,18.37 C16.A 16.66,17.7 15.98,17.7 15.69,17.41 C17.2 | U2.5 16.52,23.12 16.71,23.31 18.21,23.31 LED1.A
6  (via drill 0.25)
  Top 0.203: v33.04,16.68 33.96,17.6 33.96,18.24 UC1.15
  Bottom 0.203: U$3.16 27.08,16.61 27.08,16.2 27.23,16.05 32.72,16.05 32.87,16.2 32.87,16.52 v33.04,16.68
7  (via drill 0.25)
  Top 0.203: UC1.14 35.01,18.6 35.01,18.95 34.24,19.72 v34.24,19.93
  Bottom 0.203: R23.2 R22.1 30.17,25.77 30.17,24.03 30.01,23.86 30.01,21.87 29.63,21.5 29.63,19.39 30.01,19.02 30.52,19.02 30.67,19.17 32.47,19.17 32.53,19.11 33.19,19.11 34.01,19.93 v34.24,19.93
10  (via drill 0.25)
  Top 0.203: 35,15.07 UC1.11 34.65,15.24 35,14.9 35,14.09 34.64,13.73 34.64,13.31 34.35,13.01 34.27,13.01 v34.12,12.86
  Bottom 0.203: v34.12,12.86 33.54,12.86 U$3.8
11  (via drill 0.25)
  Top 0.203: v34.14,13.52 34.14,13.83 34.64,14.34 34.64,14.72 UC1.10
  Bottom 0.203: U$3.7 31.58,12.12 32.99,13.52 v34.13,13.52 v34.14,13.52
15  (via drill 0.25)
  Top 0.203: UC1.43 27.58,13.99 28.12,13.99 29.23,12.88 v29.28,12.88
  Bottom 0.203: v29.28,12.88 29.98,12.18 U$3.5
16  (via drill 0.25)
  Top 0.203: v27.35,14.48 v27.35,14.47 UC1.42
  Bottom 0.203: U$3.1 26.77,12.39 27.05,12.67 27.05,14.18 v27.35,14.48
23_USBDP
  Top 0.203: R10.1 29.23,24.8 | C11.2 29.23,24.8 | R7.1 27.39,24.69 28.74,24.69 28.85,24.8 29.23,24.8
24_USBDM
  Top 0.203: R6.1 27.27,25.29 C10.2
25  (via drill 0.25)
  Top 0.203: UC1.31 27.22,19.31 27.22,17.71 28.51,16.42 v28.51,14.32
  Bottom 0.203: U$3.2 27.58,13.45 28.46,14.32 v28.51,14.32
26  (via drill 0.25)
  Top 0.203: UC1.30 27.58,19.66 27.58,17.87 29.02,16.42 v29.02,13.9
  Bottom 0.203: U$3.3 28.33,11.75 28.33,13.21 v29.02,13.9
27  (via drill 0.25)
  Top 0.203: UC1.29 27.93,20.01 27.93,18.02 29.54,16.42 29.54,13.58 v29.76,13.36
  Bottom 0.203: U$3.4 29.18,12.13 28.69,12.61 28.69,13.07 29.02,13.39 29.5,13.39 29.54,13.36 v29.76,13.36
32  (via drill 0.25)
  Top 0.203: UC1.45 UC1.44 27.07,12.77 SJ1.1 26.12,12.02 25.88,11.78 25.01,11.78 24.87,11.64 24.87,10.71 25.1,10.48 26.27,10.48 26.45,10.3 26.45,9.57 26.15,9.27 25.94,9.27 v25.75,9.08
  Bottom 0.203: v25.75,9.08 25.75,8.96 24.79,8 24.79,6.42 R9.2
33  (via drill 0.25)
  Top 0.203: UC1.19 33.74,20.86 33.74,22.29 v33.66,22.38 | v29.42,22.35 29.57,22.35 29.95,22.72 29.95,23.32 30.55,23.92 31.06,23.92 31.9,23.09 v32.27,23.09
  Bottom 0.203: R1.2 29.4,22.37 v29.42,22.35 | v33.66,22.38 v33.65,22.38 33.38,22.64 32.56,22.64 32.27,22.94 v32.27,23.09
+5V/2  (via drill 0.25)
  Top 0.203: v26.34,20.91 26.29,20.96 24.91,20.96 24.75,21.12 24.75,26.45 25.23,26.93 R8.2 25.7,26.93 v26,26.63
  Bottom 0.203: v26.34,20.91 26.34,19.11 D2.2 | v26,26.63 PAD18.1
AV+  (via drill 0.25)
  Top 0.203: UC1.9 33.89,14.71 33.24,15.36 32.81,15.36 32.23,14.78 31.35,14.78 30.97,15.16 30.97,17.01 29.69,18.3 29.69,18.6 29.68,18.6 29.68,18.92 v30.3,19.54 | v34.29,22.16 34.73,22.6 34.73,22.98 IC2.2 34.78,22.94 C4.1
  Bottom 0.203: v30.3,19.54 30.3,19.76 31.17,20.62 31.56,20.62 C3.1 32.35,20.05 31.49,20.91 31.49,22.13 31.64,22.29 33.05,22.29 33.2,22.14 33.2,21.99 33.34,21.86 33.99,21.86 v34.29,22.16
AV-  (via drill 0.25)
  Top 0.203: UC1.8 33.2,14.74 33.14,14.74 v33.03,14.85 | C4.2 34.86,21.33 IC2.1 34.56,21.33 v34.73,21.16
  Bottom 0.203: v33.03,14.85 v33.02,14.86 33.02,15.84 33.28,16.11 33.28,16.2 33.43,16.35 33.52,16.35 33.83,16.66 | 34.76,21.05 34.72,21.1 v33.23,21.1 32.69,21.64 C3.2 | 34.76,21.05 34.76,21.13 v34.73,21.16 | 33.83,16.66 | 33.83,16.66 33.83,18.15 L1.1 35,19.31 35,19.9 34.72,20.18 34.72,21.01 34.76,21.05
CLKIN1
  Top 0.203: SJ2.2 29.19,1.91 29.38,1.91 28.38,2.91 27.31,2.91 U1.1
DISC
  Top 0.203: UC1.46 28.29,12.51 27.2,11.42 25.83,11.42 R5.1
FSYNC1
  Top 0.203: SJ3.2 34,1.88 33.93,1.94 33.93,5.36 33.2,6.1 32.01,6.1 31.56,6.55 30.71,6.55 U1.11
GND  (via drill 0.25)
  Top 0.203: C7.2 | C7.2 C5.2 | IC1.1 26.26,22.73 26.26,22.02 PAD17.1 | v25.37,19.6 25.37,19.21 25.12,18.96 25.12,18.58 UC1.35 | C6.2 28.75,0.85 SJ2.1 29.05,0.85 C12.1 C14.1 C13.1 32.81,1.09 v33.45,1.09 34.01,1.09 SJ3.1 | R11.1 34.83,27 C7.2 | v28.55,26.57 28.7,26.57 28.72,26.59 28.71,26.59 C10.1 C11.1 | v32.05,24.67 32.52,24.67 C2.2 | UC1.23 31.14,21.09 31.14,21.06 31.01,20.93 31.01,20.46 30.81,20.27 30.81,19.33 30.19,18.71 v30.19,18.51 | U1.18 v27.13,8.02 27.44,8.32 27.44,8.38 28.05,8.98 v28.05,9.34 28.05,9.75 27.41,10.39 27.41,10.99 UC1.47 | v31.87,18.64 32.04,18.47 32.04,16.96 32.83,16.17 33.25,16.17 33.96,16.89 v34.35,16.89 | 29.91,10.84 SJ4.2 29.86,9.87 v29.9,9.83 | v29.91,9.84 v29.9,9.83 | Q3.2 32.54,9.06 31.97,9.63 30.1,9.63 v29.9,9.83
  Bottom 0.203: 28.55,27.2 24.87,27.2 24.87,20.56 D1.C | 28.55,27.2 32.58,27.2 33.18,26.59 | PAD17.1 26.25,22.03 25.34,21.12 D1.C | 27.96,7.3 Q1.2 | Q1.2 28.96,6.3 33.02,6.3 33.71,5.62 33.71,5.12 33.45,4.86 v33.45,1.09 | L1.2 34.6,16.88 v34.35,16.89 | v32.05,24.67 32.05,24.84 32.05,24.93 32.05,25.05 R23.1 31.93,25.26 33.18,26.51 33.18,26.59 | 33.18,26.44 33.25,26.51 PAD15.1 | PAD15.1 34.44,26.99 R11.1 | 28.55,27.2 28.78,26.96 C1.C 28.77,26.57 v28.55,26.57 | D1.C 25.29,20.51 25.37,20.43 v25.37,19.6 25.62,19.34 25.62,18.45 25.94,18.13 27.6,18.13 27.96,17.77 29.01,17.77 29.18,17.6 U$3.13 U$3.12 29.98,18.29 v30.19,18.51 31.74,18.51 v31.87,18.64 | 34.36,16.15 v34.36,16.88 v34.35,16.89 | Q1.2 27.9,7.26 v27.14,8.02 v27.13,8.02 27,8.15 26.05,8.15 25.75,7.85 25.75,7.28 R9.1 | v28.05,9.34 28.05,10.1 28.39,10.45 29.52,10.45 29.91,10.07 v29.91,9.84 30.04,9.7 33.37,9.7 34.69,11.02 34.69,15.43 34.35,15.77 v34.35,16.89 | PAD15.1 33.18,26.59
  other vias: 26.33,21.95 34.84,26.99 33.78,27
MAG_GND  (via drill 0.25)
  Top 0.203: v5.01,23.22 5.61,23.82 D3.C v6.51,24.2 | v5.01,23.22 | v2.31,17.54 U4.4 | U4.4 2.76,17.53 5.52,20.28 v5.52,21.6 | D4.C 6.17,14.7 4.96,15.91 4.96,16.99 4.43,17.53 U4.4
  Bottom 0.203: v5.52,21.6 PAD4.1 5.04,23.19 v5.01,23.22 | v6.51,24.2 | v6.51,24.2 6.22,24.5 5.67,24.5 C15.2 | v2.31,17.54 3.81,17.54 4.27,18 4.39,18 SJ7.2
MAG_OUT  (via drill 0.25)
  Top 0.203: U4.3 v2.31,18.81
  Bottom 0.203: v2.31,18.81 2.31,19.28 2.87,19.84 2.87,21.72 3.22,22.07 PAD13.1
MAG_PWR  (via drill 0.25)
  Top 0.203: U4.2 U4.1 2.45,21.2 3.55,21.2 v4.5,20.25 | R24.2 5.66,16.8 4.65,17.81 4.65,18.91 6.03,20.29 6.03,21.88 5.66,22.25 R21.2
  Top 0.254: R21.2 6.45,22.49 PAD7.1
  Bottom 0.203: C15.1 4.35,24.5 2.97,24.5 2.29,23.82 2.29,20.09 U4.2 | PAD7.1 6.83,21.53 5.88,20.58 4.87,20.58 4.5,20.21 SJ8.1 v4.5,20.25
  other vias: 6.83,22.11 2.31,20.07
MOT1_IN1  (via drill 0.25)
  Bottom 0.203: U$1.9 14.3,16.1 14.09,15.88 13.67,15.88 13.3,16.25 13.3,16.7 12.96,17.05 12.96,18.08 13.31,18.43 13.31,19.15 12.95,19.52 12.95,23.61 13.53,24.19 16.76,24.19 17.12,23.84 19.33,23.84 19.81,24.31 IC4.2
  other vias: 21.09,24.31
MOT1_IN2  (via drill 0.25)
  Bottom 0.203: IC4.3 20.58,25.58 19.19,24.19 17.27,24.19 16.91,24.55 13.31,24.55 12.59,23.83 12.59,19.37 12.96,19 12.96,18.58 12.6,18.23 12.6,16.9 12.95,16.55 12.95,16.12 12.7,15.87 12.7,14.39 14.53,12.57 U$1.8
  other vias: 21.09,25.58
MOT2_IN1  (via drill 0.25)
  Top 0.203: IC6.2 v21.59,18.77 v21.6,18.76
  Bottom 0.203: U$1.11 16.43,16.4 16.43,16.81 16.58,16.96 21.33,16.96 21.61,17.25 21.61,18.75 v21.6,18.76
MOT2_IN2  (via drill 0.25)
  Top 0.203: IC6.3 v21.6,20.04
  Bottom 0.203: U$1.10 15.63,16.4 15.63,16.81 16.14,17.32 21.18,17.32 21.26,17.39 21.26,18.38 21.09,18.55 21.09,18.97 21.6,19.48 v21.6,20.04
MOT3_IN1  (via drill 0.25)
  Top 0.203: v21.27,8.19 21.32,8.14 21.35,8.2 21.09,7.94 IC8.2
  Bottom 0.203: v21.27,8.19 21.42,8.34 21.42,8.96 19.32,11.05 19.32,12.29 U$1.2
MOT3_IN2  (via drill 0.25)
  Top 0.203: IC8.3 20.91,9.06 20.07,9.9 20.07,10.76 20.08,10.77 v20.08,11.19
  Bottom 0.203: v20.08,11.19 20.13,11.24 U$1.1
MOT4_IN1  (via drill 0.25)
  Top 0.203: v21.15,2.77 21.11,2.28 IC10.2
  Bottom 0.203: v21.15,2.77 21.1,2.77 20.81,3.06 20.81,4.22 19.72,5.31 19.72,9.64 17.74,11.62 17.74,12.29 U$1.4
MOT4_IN2  (via drill 0.25)
  Top 0.203: IC10.3 21.34,3.86 v21.33,3.85
  Bottom 0.203: U$1.3 18.53,11.34 20.08,9.79 20.08,5.46 21.33,4.2 v21.33,3.85
MOT5_IN1  (via drill 0.25)
  Bottom 0.203: U$1.5 16.95,12.33 16.95,12.73 17.93,13.71 20.67,13.71 IC12.2
  other vias: 21.09,13.29
MOT5_IN2  (via drill 0.25)
  Bottom 0.203: U$1.7 15.34,12.97 15.87,13.5 16.99,13.5 17.55,14.07 20.6,14.07 IC12.3
  other vias: 21.09,14.56
N$1  (via drill 0.25)
  Top 0.203: SJ1.2 25.27,12.83 R2.1
  other vias: 25.27,13.61
N$2
  Bottom 0.203: R1.1 28.1,20.79 D1.A
N$4  (via drill 0.25 pad 0.51, 0.35)
  Top 0.203: UC1.13 35.25,17.65 v35.25,16.28 | v31.74,9.07 31.74,8.23 Q3.3 34.44,8.11 34.78,7.77 34.78,5.39 R4.1
  Bottom 0.203: v31.74,9.07 32.02,9.35 33.52,9.35 35.25,11.07 v35.25,16.28
N$6
  Bottom 0.203: SJ5.2 19.84,1.06 18.07,2.82 U$2.SSWTCH_-
N$7
  Top 0.203: U1.8 30.74,5.03 31.16,5.03 31.46,4.74 31.46,3.55 30.27,2.37 30.27,2.25 C12.2
N$8  (via drill 0.25)
  Top 0.203: 26.46,6.5 U1.20 25.99,6.54 25.73,6.8 25.73,7.33 26.03,7.64 v26.26,7.64 | C13.2 32.85,2.15 32.85,4.99 v33.2,5.33
  Bottom 0.203: v33.2,5.33 33.2,5.59 32.84,5.94 27.53,5.94 26.42,7.05 26.42,7.48 v26.26,7.64
N$9
  Top 0.203: 31.43,2.19 C14.2 31.82,2.5 31.82,5.29 31.08,6.03 U1.10 | U1.10 31.04,6.03 | 30.96,6.06 30.73,6.06 U1.10
N$11
  Top 0.61: IC12.8 15.62,12.02 15.27,12.04 PAD5.1
N$12
  Top 0.305: R16.2 15.65,18.75 IC6.7
N$13
  Top 0.61: IC12.6 13.5,14.56 PAD6.1
N$14
  Top 0.61: 15.56,9.06 IC8.6 PAD2.1 | 15.56,9.06 | 15.56,9.06 15.56,9.07
N$15
  Top 0.61: IC8.8 13.5,6.52 PAD1.1
N$16  (via drill 0.25)  (1 unrouted)
  Top 0.5: v2.73,10.09 2.73,10.47
  Bottom 0.5: v2.73,10.99 U$5.1 v2.73,10.09
N$17
  Top 0.61: IC10.6 13.48,3.53 PAD8.1
N$18
  Top 0.61: IC10.8 PAD3.1
N$19
  Top 0.61: PAD12.1 15.64,20.06 IC6.6
N$20
  Top 0.61: IC6.8 15.56,17.5 | 15.56,17.5 | 15.56,17.5 15.56,17.49 PAD11.1
N$21
  Top 0.61: IC4.6 15.66,25.6 PAD10.1
N$22
  Top 0.61: PAD9.1 15.65,23.03 IC4.8
N$23
  Top 0.305: R17.2 15.65,2.25 IC10.7
N$24
  Top 0.305: R18.2 IC8.7
N$25
  Top 0.305: R19.2 IC12.7
N$26
  Top 0.305: R15.2 15.65,24.3 IC4.7
N$28
  Top 0.203: D3.A R21.1
N$29  (via drill 0.25)
  Top 0.203: U4.8 7.44,21.34 6.51,20.41 v6.51,18.88
  Bottom 0.203: SJ8.2 5.71,19.68 v6.51,18.88 5.75,18.12 5.52,18.12 SJ7.1
N$30
  Bottom 0.203: R20.2 14.01,18.83 14.01,18.96 13.3,19.66 13.3,20.96 14.25,21.91 16.62,21.91 LED1.C
N$32
  Top 0.203: R24.1 4.36,16.15 3.51,15.27 D4.A
N$33  (via drill 0.25)  (1 unrouted)
  Top 0.5: v2.73,1.66 v2.73,0.59
  Bottom 0.203: U$8.1 v2.73,0.59
  Bottom 0.5: v2.73,1.66 U$8.1
N$34  (via drill 0.25)
  Top 0.5: U$6.2 v3.52,10.1 v3.53,10.09
  Bottom 0.5: U$5.2 v3.53,10.09 v3.53,10.99
N$35  (via drill 0.25)
  Top 0.5: U$6.3 v4.33,10.09
  Bottom 0.5: U$5.3 v4.33,10.09 v4.33,10.99
N$36  (via drill 0.25)
  Top 0.5: U$6.4 v5.13,10.09
  Bottom 0.5: U$5.4 v5.13,10.09 v5.13,10.99
N$37  (via drill 0.25)
  Top 0.5: v5.93,10.09 U$6.5
  Bottom 0.5: U$5.5 v5.93,10.09 v5.93,10.99
N$38  (via drill 0.25)
  Top 0.5: U$6.6 v6.73,10.09
  Bottom 0.5: v6.73,10.09 U$5.6 v6.73,10.99
N$39  (via drill 0.25)
  Top 0.5: v7.53,10.09 U$6.7
  Bottom 0.5: U$5.7 v7.53,10.09 v7.53,10.99
N$40  (via drill 0.25)
  Top 0.5: U$6.8 v8.33,10.09
  Bottom 0.5: U$5.8 v8.33,10.09 v8.33,10.99
N$41  (via drill 0.25)
  Top 0.5: v8.33,7.69 U$6.9
  Bottom 0.203: U$5.9 v8.33,6.79
  Bottom 0.5: v8.33,7.69 U$5.9
N$42  (via drill 0.25)
  Top 0.5: U$6.10 v7.53,7.69
  Bottom 0.5: U$5.10 v7.53,7.69 v7.53,6.79
N$43  (via drill 0.25)
  Top 0.5: U$6.11 v6.73,7.69
  Bottom 0.5: U$5.11 v6.73,7.69 v6.73,6.79
N$44  (via drill 0.25)
  Top 0.5: U$6.12 v5.93,7.69
  Bottom 0.5: U$5.12 v5.93,7.69 v5.93,6.79
N$45  (via drill 0.25)
  Top 0.5: U$6.13 v5.13,7.69 v5.13,6.79
  Bottom 0.5: U$5.13 v5.13,7.69 v5.13,6.79
N$46  (via drill 0.25)
  Top 0.5: U$6.14 v4.33,7.69
  Bottom 0.5: U$5.14 v4.33,7.69 v4.33,6.79
N$47  (via drill 0.25)
  Top 0.5: v3.53,7.69 U$6.15
  Bottom 0.5: U$5.15 v3.53,7.69 v3.53,6.79
N$48  (via drill 0.25)
  Top 0.5: v2.73,7.69 U$6.16
  Bottom 0.5: v2.73,7.69 v2.73,6.79 U$5.16
N$49  (via drill 0.25)
  Top 0.5: U$7.2 v3.53,1.66 v3.53,0.59
  Bottom 0.5: U$8.2 v3.53,1.66
N$50  (via drill 0.25)
  Top 0.5: U$7.3 v4.33,1.66 v4.33,0.59
  Bottom 0.5: U$8.3 v4.33,1.66
N$51
  Top 0.203: R10.2 30.56,24.53 Q2.2
N$52  (via drill 0.25)
  Top 0.5: U$7.4 v5.13,1.66 v5.13,0.59
  Bottom 0.5: U$8.4 v5.13,1.66
N$53  (via drill 0.25)
  Top 0.5: v5.93,0.59 U$7.5 v5.93,1.66
  Bottom 0.203: U$8.5 v5.93,0.59
  Bottom 0.5: v5.93,1.66 5.93,0.98
N$54  (via drill 0.25)
  Top 0.5: U$7.6 v6.73,1.66 v6.73,0.59
  Bottom 0.5: v6.73,1.66 U$8.6
N$55  (via drill 0.25)  (1 unrouted)
  Top 0.5: v7.53,1.66 U$7.7
  Bottom 0.5: U$8.7 v7.53,1.66
  other vias: 7.53,0.59
N$56  (via drill 0.25)
  Top 0.5: U$7.8 v8.33,1.66 v8.33,0.59
  Bottom 0.5: v8.33,1.66 U$8.8
N$57  (via drill 0.25)
  Top 0.5: v8.33,4.88 U$7.9
  Bottom 0.203: U$8.9 v8.33,5.89
  Bottom 0.5: v8.33,4.88 U$8.9
N$58  (via drill 0.25)
  Top 0.5: v7.53,5.89 U$7.10 v7.53,4.88
  Bottom 0.203: U$8.10 7.53,5.52
  Bottom 0.5: 7.53,5.52 v7.53,4.88
N$59  (via drill 0.25)
  Top 0.203: v25.27,25.23 25.27,25.66 R6.2
  Bottom 0.203: PAD19.1 26.03,25.15 25.27,25.36 v25.27,25.23
N$60  (via drill 0.25)
  Top 0.203: R7.2 26.33,24.12 v26.33,23.65
  Bottom 0.203: PAD20.1 v26.33,23.65
N$61  (via drill 0.25)
  Top 0.5: U$7.11 v6.73,4.88 v6.73,5.89
  Bottom 0.5: v6.73,4.88 U$8.11
N$62  (via drill 0.25)
  Top 0.5: U$7.12 v5.93,4.88 v5.93,5.89
  Bottom 0.203: U$8.12 v5.93,5.89
  Bottom 0.5: v5.93,4.88 v5.93,5.89
N$63  (via drill 0.25)
  Top 0.5: U$7.13 v5.13,4.88 v5.13,5.89
  Bottom 0.5: U$8.13 v5.13,4.88
N$64  (via drill 0.25)  (1 unrouted)
  Top 0.5: v4.33,4.88 v4.33,5.89
  Bottom 0.203: U$8.14 v4.33,5.89
  Bottom 0.5: U$8.14 v4.33,4.88
N$65  (via drill 0.25)
  Top 0.5: U$7.15 v3.53,4.88
  Bottom 0.5: U$8.15 v3.53,4.88 v3.53,5.89
N$66  (via drill 0.25)
  Top 0.5: v2.73,4.88 U$7.16
  Bottom 0.203: 2.73,5.52 U$8.16 v2.73,5.89
  Bottom 0.5: 2.73,5.52 v2.73,4.88
N$71  (via drill 0.25)
  Top 0.203: R8.1 26.76,26.9 26.86,26.9 27.37,26.39 27.37,26.24 27.64,25.97 29.94,25.97 Q2.1 | R11.2 34.84,25.79 34.25,26.39 30.75,26.39 Q2.1 | Q2.1 30.56,26.24 31.53,25.27 31.53,24.36 31.72,24.16 v31.72,23.98 | v30.85,13.23 29.69,12.07 29.69,12.04 29.03,11.37 29.03,9.99 v29.14,9.88 | 30.05,13.98 v30.05,13.95 30.05,14.57 29.9,14.72 29.9,16.56 28.3,18.16 28.3,19.49 29.64,20.83 29.64,21.03 30.08,21.48 30.08,22.27 30.3,22.48 30.3,22.81 v30.88,23.38
  Bottom 0.203: v30.85,13.23 30.12,13.95 v30.05,13.95 | v30.88,23.38 31.47,23.98 v31.72,23.98 | v29.14,9.88 29.14,9.64 Q1.3
N$73  (via drill 0.25)
  Top 0.203: v25.63,9.91 v25.62,9.91 R5.2
  Bottom 0.203: R12.1 29.94,7.23 Q1.1 29,7.26 28.76,7.5 28.76,8.06 28.61,8.21 27.66,8.21 27.31,8.56 26.56,8.56 26.29,8.83 26.29,9.26 25.96,9.59 25.95,9.59 v25.63,9.91
OSC_IN
  Top 0.203: 32.5,13.29 UC1.5
PWR_GND  (via drill 0.25, 0.35, 0.45)
  Top 0.203: v12.73,2.25 R17.1 | IC4.9 19.13,24.95 v19.18,24.9 | IC4.9 18.62,24.7 v18.67,24.7 | IC4.9 18.31,24.95 v18.07,24.7 | v17.68,25.35 18.08,24.95 IC4.9 | IC4.9 18.48,25.05 v18.48,26.1 | IC4.9 18.62,24.95 v19.18,25.5 | v20.74,17.82 21.07,17.5 IC6.1 | v13.88,16.39 13.83,16.34 v12.44,16.34 | v12.54,24.53 12.85,24.53 R15.1 | v17.68,26.35 v17.68,26.85 | v17.19,8.41 18.35,8.41 IC8.9 | IC8.9 18.22,8.43 17.65,9 | 17.68,9.1 17.65,9.07 18.29,8.43 IC8.9 | IC8.9 18.38,8.4 | IC8.9 17.67,7.73 17.25,7.73 | 17.25,7.73 v17.19,7.73 | IC12.9 18.38,15.1 | IC12.9 18.38,14.35 17.73,15 | IC12.9 18.38,14.41 v17.72,15.07 | IC12.9 18.38,14.47 v19,15.09 | IC12.9 18.38,15.05 v18.34,15.09 | v13.03,5.34 14.76,5.34 15.36,5.95 16.53,5.95 16.68,6.1 16.68,7.16 17.25,7.73
  Top 0.254: v12.45,18.79 13.04,18.79 R16.1 | v16.82,19.59 18.19,19.59 IC6.9
  Top 0.305: v16.96,16.1 16.96,15.35 IC12.9 | 17.73,15 U$1.13
  Top 0.61: 18.38,12.02 IC12.9 | 18.38,15.1 18.38,17.5 | 18.38,23.04 IC6.9 18.38,17.5 | 18.38,23.04 IC4.9 | 18.04,5.37 18.04,7.08 18.33,7.36 18.33,8.35 18.38,8.4 18.38,12.02 | 18.04,5.37 18.04,3.23 IC10.9 18.38,1.75 19.14,0.99 IC10.1 | v21.08,11.2 IC12.1 18.38,12.02 | IC6.1 18.38,17.5 | IC4.1 18.38,23.04 | IC8.1 21.05,6.49 20.73,6.49 19.61,5.37 18.04,5.37
  Top 1.016: IC4.9 18.38,26.55 v18.18,26.55 v17.18,26.55 v17.18,25.65
  Bottom 0.203: GND.1 16.53,26.55 v17.18,26.55 18.6,26.55 18.63,26.57 20.49,26.57 PAD22.1 | C19.C 20.65,20.59 20.65,18.15 20.32,17.81 20.7,17.81 | v20.74,17.82 v20.73,17.81 20.7,17.81 | GND.1 14.9,24.93 13.15,24.93 12.76,24.53 v12.54,24.53 12.54,24.33 12.24,24.03 12.24,19.01 v12.45,18.79 12.24,18.58 12.24,16.55 v12.44,16.34 12.24,16.14 12.24,14.14 R19.1 | 13.88,17.51 v13.88,16.39 | GND.1 16.33,26.35 v17.68,26.35 | C16.C 20.7,17.81 | 16.73,26.1 17.43,26.1 v17.68,25.85 | 16.73,26.1 v17.18,25.65 | GND.1 16.73,26.1 | GND.1 17.73,26.1 v18.18,25.65 | v18.07,24.7 17.66,25.11 17.66,25.32 17.33,25.65 | v12.73,2.25 12.73,5.55 | 12.73,5.55 12.73,7.45 R18.1 | U3.5 17.13,8.47 v17.19,8.41 | 12.73,5.55 12.93,5.34 v13.03,5.34
  Bottom 0.254: U2.2 15.05,18.58 13.88,17.41 C17.1 13.88,17.51 | v17.48,24.7 16.88,25.3 v16.88,26.1 | v18.67,24.7 17.72,25.65 17.51,25.65 | v19.18,24.9 18.05,26.03 | 18.05,26.03 17.18,26.03 | v19.18,25.5 18.65,26.03 18.05,26.03 | v19.18,26.1 18.73,26.55 18.6,26.55 | R20.1 15.88,18.81 16.65,19.59 v16.82,19.59
  Bottom 0.305: U$1.12 v16.96,16.1 | 14.11,26.1 GND.1
  Bottom 0.61: 21.07,11.14 21.08,11.15 v21.08,11.2 | v17.18,25.65 17.18,26.03 v17.18,26.55 v18.18,26.55 | 17.33,25.65 17.51,25.65 v18.18,25.65 18.18,26.35 | 18.18,26.35 | 18.18,26.35 v18.18,26.55 | v18.18,26.55
  other vias: 13.08,13.3 13.08,7.8 17.73,16.1
  pour Bottom: 11.28,27.65 22.48,27.65 22.48,0.25 11.28,0.25
PWR_VCC  (via drill 0.25)
  Top 0.203: v18.79,6.08 18.79,6.1 19.86,7.16 v22.12,7.16 | 21.63,26.85 IC4.4 21.63,26.85
  Top 0.305: 22.23,10.35 22.23,15.9 | 22.23,15.9 22.23,21.25 | IC6.4 22.17,21.3 22.23,21.25 | U$1.15 19.59,15.83 IC12.4 21.09,15.9 22.23,15.9 | IC8.4 21.09,10.35 22.23,10.35 | 22.23,10.35 22.23,4.95 22.08,4.8 IC10.4 v21.08,5.65 | 22.23,21.25 22.23,26.4 21.77,26.85 IC4.4
  Bottom 0.203: v21.08,5.65 21.08,6.52 21.71,7.16 v22.12,7.16 | v18.79,6.08 v18.79,6.09 17.38,6.09 17.13,6.34 U3.12
  Bottom 0.305: U$1.14 U$1.15
  other vias: 19.33,16.1
RESET  (via drill 0.25)
  Top 0.203: v30.88,10.57 30.88,10.69 SJ4.1 | v34.06,11.91 34.1,11.95 R3.1 33.61,12.59 33.61,13.63 UC1.7
  Bottom 0.203: v34.06,11.91 33.83,11.68 33.57,11.68 32.72,10.84 31.15,10.84 v30.88,10.57
SBUSIN  (via drill 0.35)
  Top 0.203: Q3.1 33.77,7.22 v33.71,7.22
  Bottom 0.203: PAD23.1 33.94,7.22 v33.71,7.22
VBAT_CUR  (via drill 0.25, 0.35)  (1 unrouted)
  Top 0.254: v15.98,21.38 15.98,21.3
  Top 0.61: IC4.5 12.08,26.85 11.73,26.5 11.73,21.3 | 11.73,21.3 11.73,15.63 | IC6.5 | 15.98,21.3 IC6.5 | IC6.5 11.73,21.3 | IC12.5 15.46,15.63 11.73,15.63 | 11.73,15.63 11.73,10.62 v14.34,10.62 15.38,10.62 IC8.5 | 11.73,10.4 11.73,5.5 12.6,4.62 13.33,4.62 13.48,4.78 14.99,4.78 15.01,4.8 IC10.5
  Bottom 0.203: SJ5.1 20.34,2.81 20.34,4.19 19.37,5.16 19.37,9.49 17.42,11.44 16.56,11.44 16.13,11.87 U$1.6 16.13,11.89 15.67,11.44 14.18,11.44 13.96,11.66 SJ6.2 | v11.68,25.45 v11.68,27.1 | v11.68,2.35 v11.68,0.7 | v11.68,4 v11.68,0.7 | v11.68,5.65 v11.68,0.7
  Bottom 0.254: 11.68,12.34 | 11.68,9.6 v11.68,12.25 11.75,12.32 SJ6.1 | SJ6.2 13.05,11.15 | C19.A 16.24,20.76 U2.1 16,20.85 15.65,21.2 | 15.65,21.2 15.32,21.53 14.78,21.53 14.1,20.85 U2.3 | 15.65,21.2 15.83,21.38 v15.98,21.38
  Bottom 0.61: v14.34,10.62 | v14.34,10.62 v13.76,10.62 v13.22,10.62 11.69,10.62 v11.68,10.6 | v11.68,27.1 11.68,12.34 v11.68,12.25 v11.68,10.6 | v11.68,10.6 11.68,9.6 12.21,9.07 11.68,8.54 v11.68,0.7 | 14.85,10.63 14.85,10.62 v14.34,10.62
  Bottom 0.7: v11.8,9.62 11.88,9.7
  Bottom 0.813: U3.3_4 15.63,9.83 15.1,10.37 | 15.1,10.37 14.85,10.62 | 12.21,9.07 15.28,9.07 U3.3_4 | U3.3_4 14.73,9.62 v11.8,9.62 14.35,9.62 14.77,10.04 | 14.77,10.04 15.1,10.37 | v11.8,10.11 14.7,10.11 14.77,10.04
  other vias: 11.68,23.8 11.68,22.15 11.68,20.5 11.68,18.85 11.68,17.2 11.68,15.55 11.68,13.9 11.68,7.3
  pour Top: 22.48,27.6 22.48,0.2 11.47,0.2 11.28,0.4 11.28,27.7
VBAT_IN
  Bottom 0.203: U$2.SSWTCH_+ 14.88,3.2 14.46,3.2
  Bottom 0.61: U$2.SSWTCH_+ 16.11,4.13 16.11,7.8 | 14.66,3.92 15.39,3.2
  Bottom 0.813: 15.03,6.3 15.03,7.18 15.39,7.55 | U3.1_2 15.53,7.62 14.15,7.62 13.84,7.31 13.84,4.23 U$2.SSWTCH_+ 14.41,3.66 14.41,6.41 | 14.41,6.91 15.03,6.3 | 15.03,6.3 15.03,5.95
  Bottom 1.016: 14.46,3.2 15.39,3.2 15.39,7.55
VCC  (via drill 0.25, 0.25 pad 0.25, 0.35)
  Top 0.203: 28.68,11.56 28.52,11.4 28.52,9.71 29.56,8.67 v29.88,8.67 29.87,8.66 U1.13 29.87,8.1 | 28.68,11.56 UC1.48 30.34,13.22 30.34,13.44 30.64,13.74 30.86,13.74 v31.32,14.2 31.32,14.3 30.62,15.01 30.62,16.85 29.32,18.15 29.32,19.28 30.65,20.61 30.65,21.03 30.65,21.31 | v33.9,11.05 33.85,11.09 33.93,11.16 34.1,10.98 R3.2 | v25.48,17.47 25.11,17.84 UC1.36 | R13.2 25.18,0.85 | R13.2 R14.2 26.6,0.97 C6.1 | C5.1 C7.1 32.82,25.7 Q2.3 32.76,25.57 33.65,25.57 33.72,25.64 v33.72,24.91 v33.71,24.9 33.72,24.89 33.72,24.88 34.41,24.19 C2.1 | UC1.36 24.76,18.24 24.76,19.71 25.16,20.11 25.58,20.11 25.87,20.4 26.55,20.4 26.85,20.7 26.85,21.12 26.55,21.42 25.67,21.42 IC1.2 | v27.92,10.69 27.92,10.8 28.68,11.56 | v30.63,21.27 30.63,21.29 30.65,21.31 | 30.65,21.31 UC1.24 | R13.2 24.74,1.61 24.74,6.28 24.66,6.36 24.66,8.87 v24.89,9.1 | UC1.36 25.5,17.5 26.93,17.5 27.95,16.48 27.95,14.87 v27.91,14.83 | UC1.1 31.53,11.46 v31.53,10.25 | R4.2 34.9,3.97 v34.9,3.17
  Bottom 0.203: U$3.14 U$3.15 27.58,17.65 27.45,17.78 26.35,17.78 26.05,17.47 v25.48,17.47 25.27,17.27 R2.2 25.98,14.21 25.98,13.15 25.01,12.18 25.01,9.22 v24.89,9.1 | v33.71,24.9 33.84,24.9 PAD16.1 33.7,24.76 32.92,24.76 32.23,24.07 32.23,23.77 31.13,22.67 31.13,21.77 v30.63,21.27 | v33.9,11.05 33.76,10.91 33.3,10.91 32.87,10.48 31.77,10.48 v31.53,10.25 31.28,10.25 31.09,10.06 30.52,10.06 29.74,10.83 28.05,10.83 v27.92,10.69 | v27.91,14.83 27.92,14.83 28.07,14.98 30.88,14.98 31.32,14.53 v31.32,14.2 | v29.88,8.67 30.34,8.21 30.51,8.21 30.55,8.17 31.22,8.17 R12.2 32.74,6.66 33.17,6.66 34.9,4.93 v34.9,3.17
VIN  (via drill 0.25)
  Top 0.203: v28.34,23.88 28.34,23.77 27.41,22.83 27.41,22.73 IC1.3 | IC2.3 32.39,22.47 30.8,22.47 30.59,22.27 v30.59,22.05 | v30.14,20.82 28.81,19.49 v28.81,18.7 28.81,18.16 30.26,16.71 30.26,14.86 30.64,14.48 v30.64,14.25
  Bottom 0.203: v28.34,23.88 28.69,23.88 C1.A 28.8,23.77 28.8,21.89 29.28,21.41 29.28,19.16 v28.81,18.7 28.55,18.96 D2.1 | R22.2 30.57,24.86 30.57,23.89 30.36,23.68 30.36,21.82 | 30.36,21.82 30.36,21.72 30.59,21.96 v30.59,22.05 | 30.78,12.18 U$3.6 30.78,12.44 31.36,13.02 31.36,13.44 30.64,14.15 v30.64,14.25 | 30.36,21.82 30.36,21.73 30,21.36 30,20.97 v30.14,20.82
VIOUT  (via drill 0.25)
  Top 0.203: v16.78,14.01 16.93,13.86 16.93,12.63 17.15,12.4 v17.15,10.9
  Bottom 0.203: U$1.16 20.13,15.5 19.19,14.56 17.32,14.56 v16.78,14.01 | U3.10 18.34,7.46 18.76,7.46 19.01,7.71 19.01,9.22 18.33,9.9 18.33,9.91 17.34,10.9 v17.15,10.9

### Text on the board
tNames: Quack 1 | + | - | Quack 2 | + | Warranty / Viod / if visible | - | Quack 3 | + | - | IDK? | lol jks, no warrent to start with | RST | Quack 4 | + | Right 'round like a record, baby | Right 'round, 'round, 'round | - | Goose 5 | + | You spin me right 'round, baby | You spin me right 'round, baby | CLKIN | FSYNC | -
bNames: Smol Gnd | GROUNDDDD | Out | Gnd | 3v | 5 Pixies | Der-P | UwUSB | Spinny Mag | Der-M | G+-5 | Sometimes / On | Never gonna give you up / Never gonna let you down / Never gonna run around and / Never gonna make you cry / Never gonna say goodbye / Never gonna tell a lie a / Never gonna let you / Never gonna run ar / Never gonna make / Never gonna say go / Never gonna tell a | SBSUS In | Ded / Mount | Live Mount | Allways / On | Uselesss | More Uselesss